# EAGLE board MecaArm_Final (EAGLE 9.7.0)
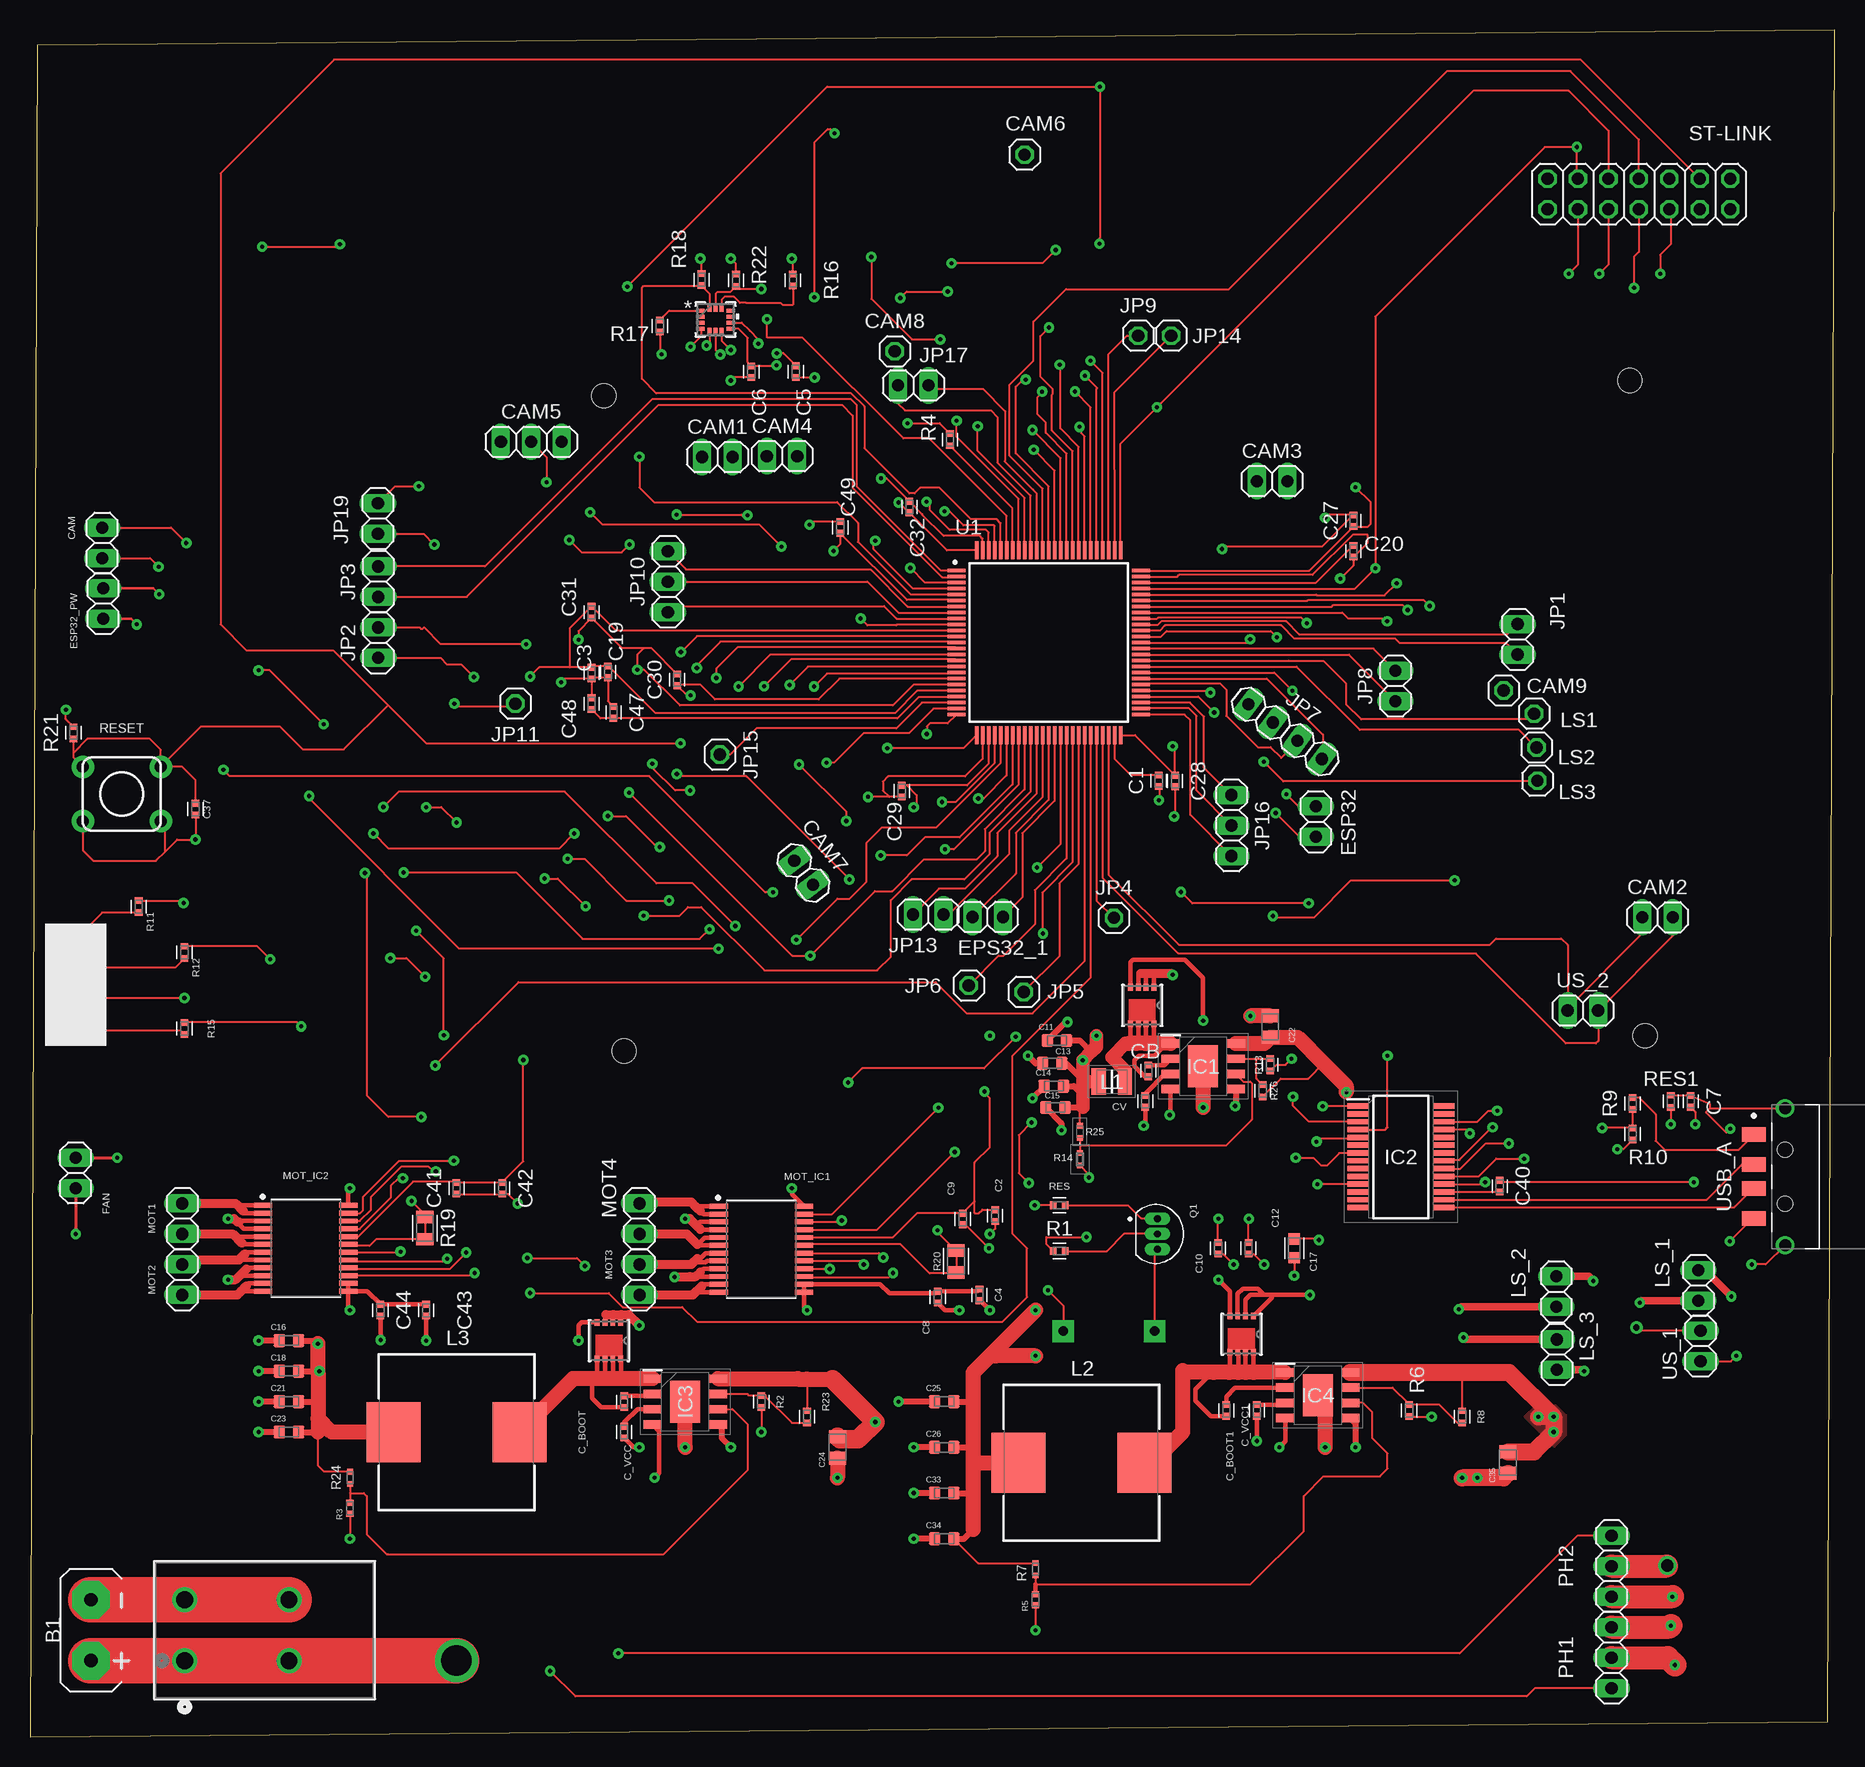
[diagram p2: board, top side]
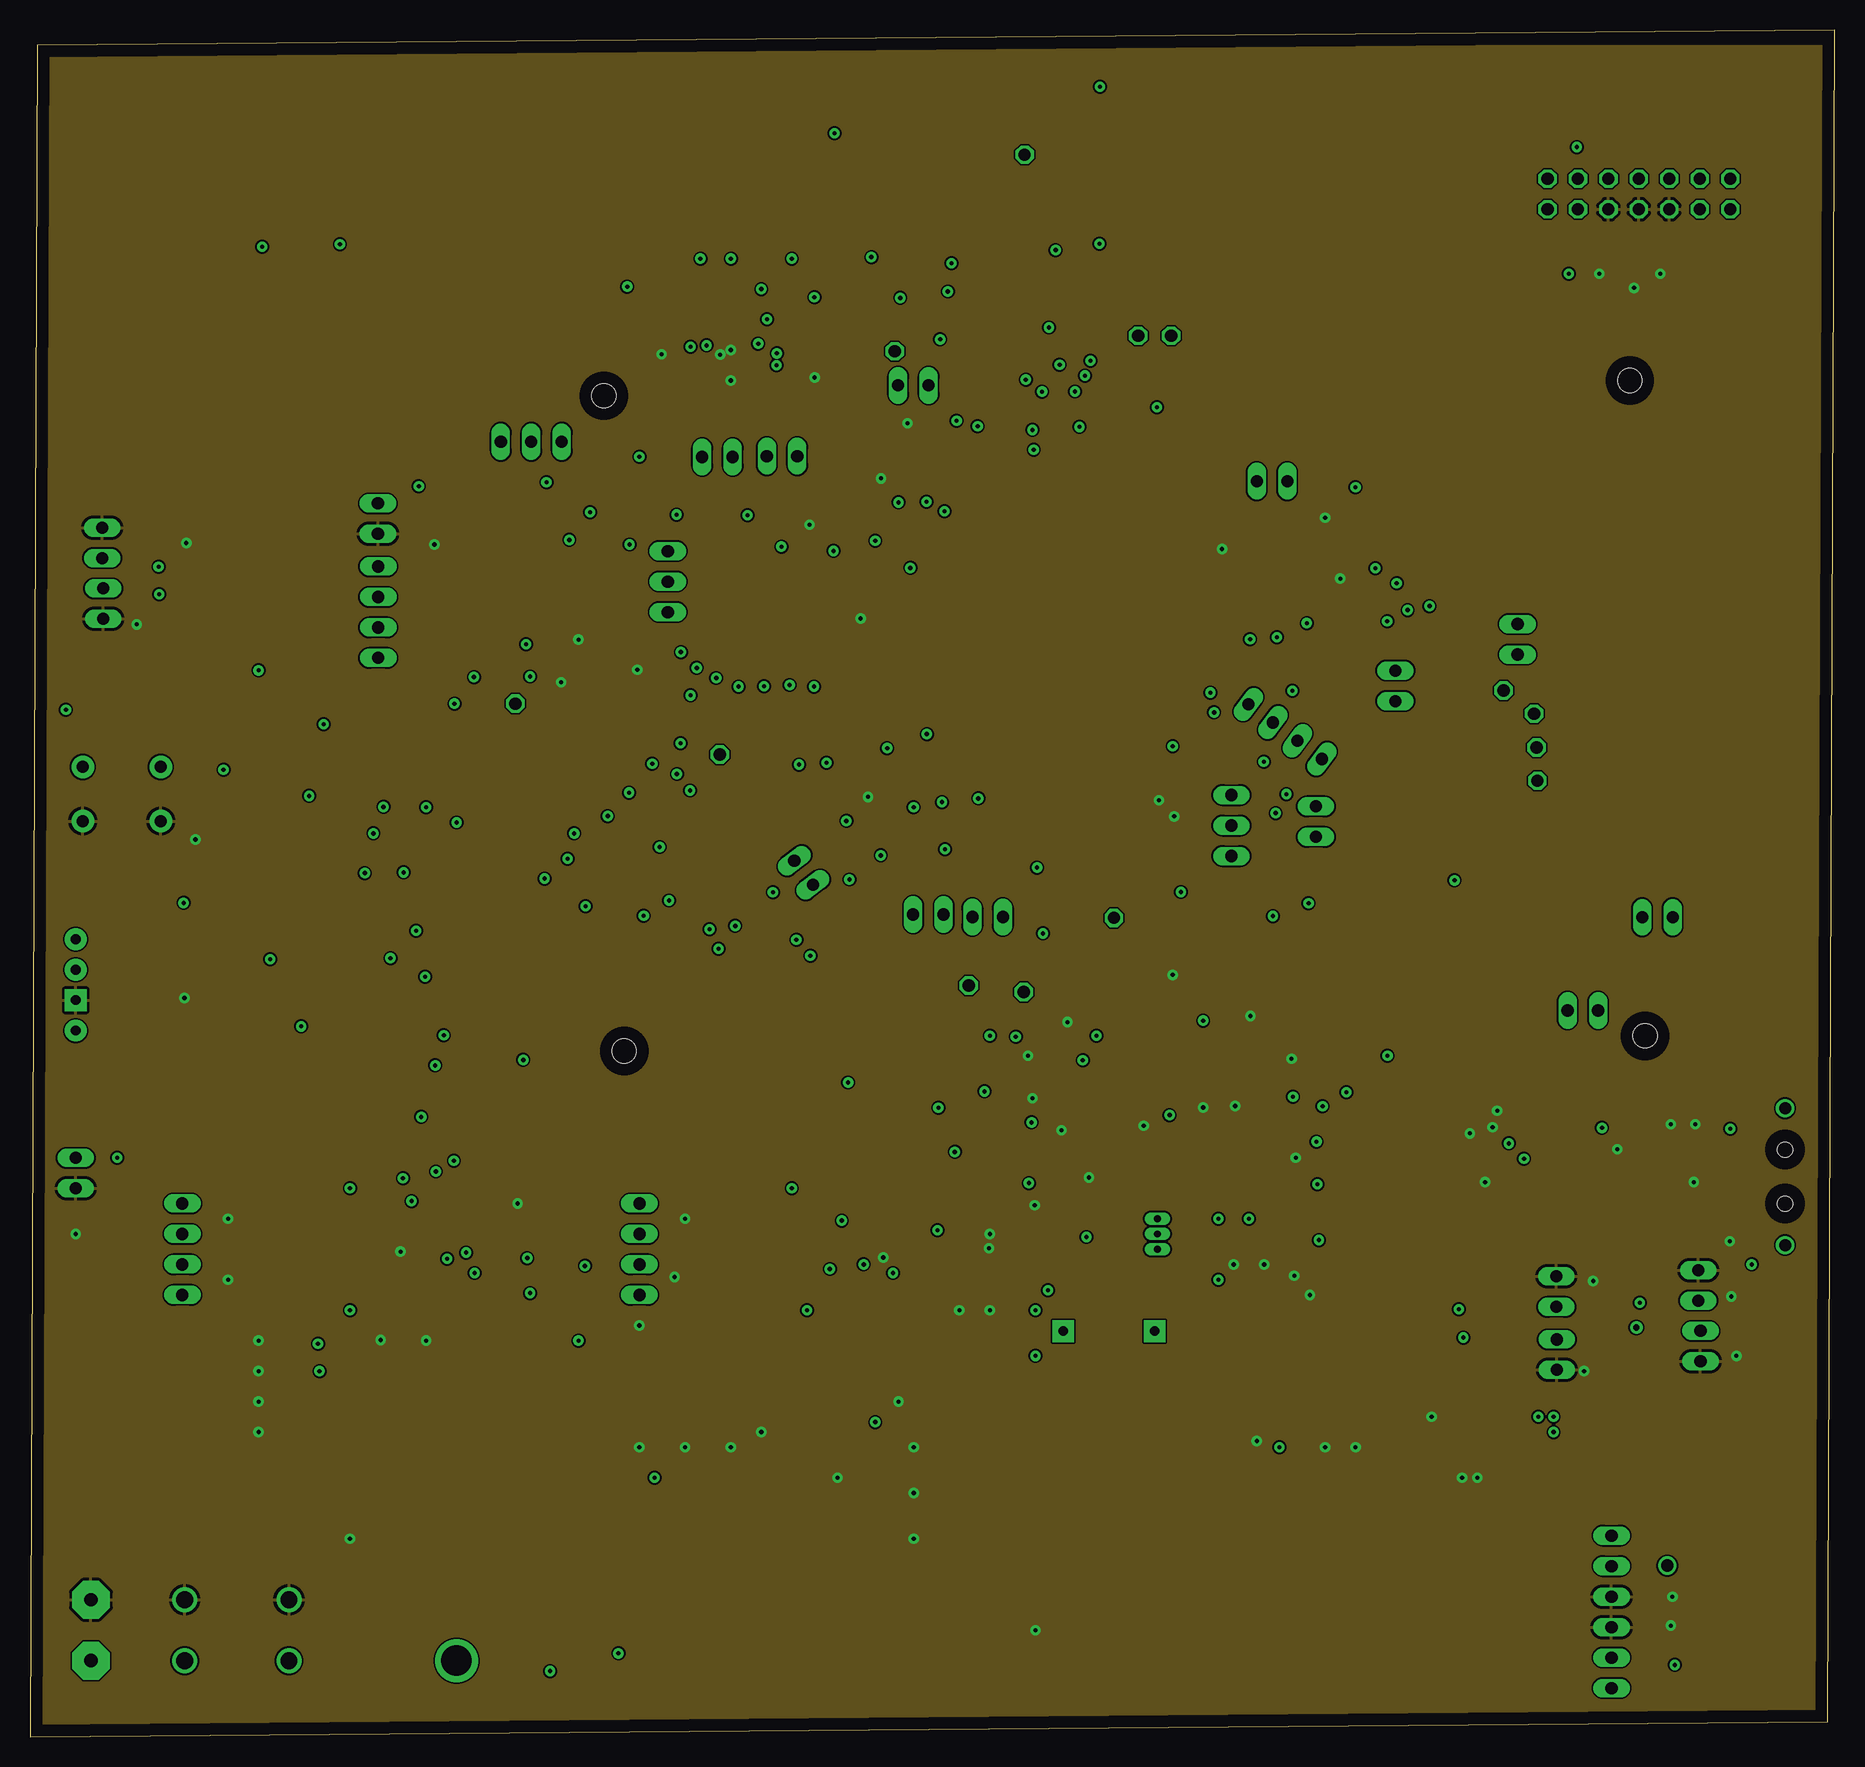
[diagram p3: board, inner layer Route2]
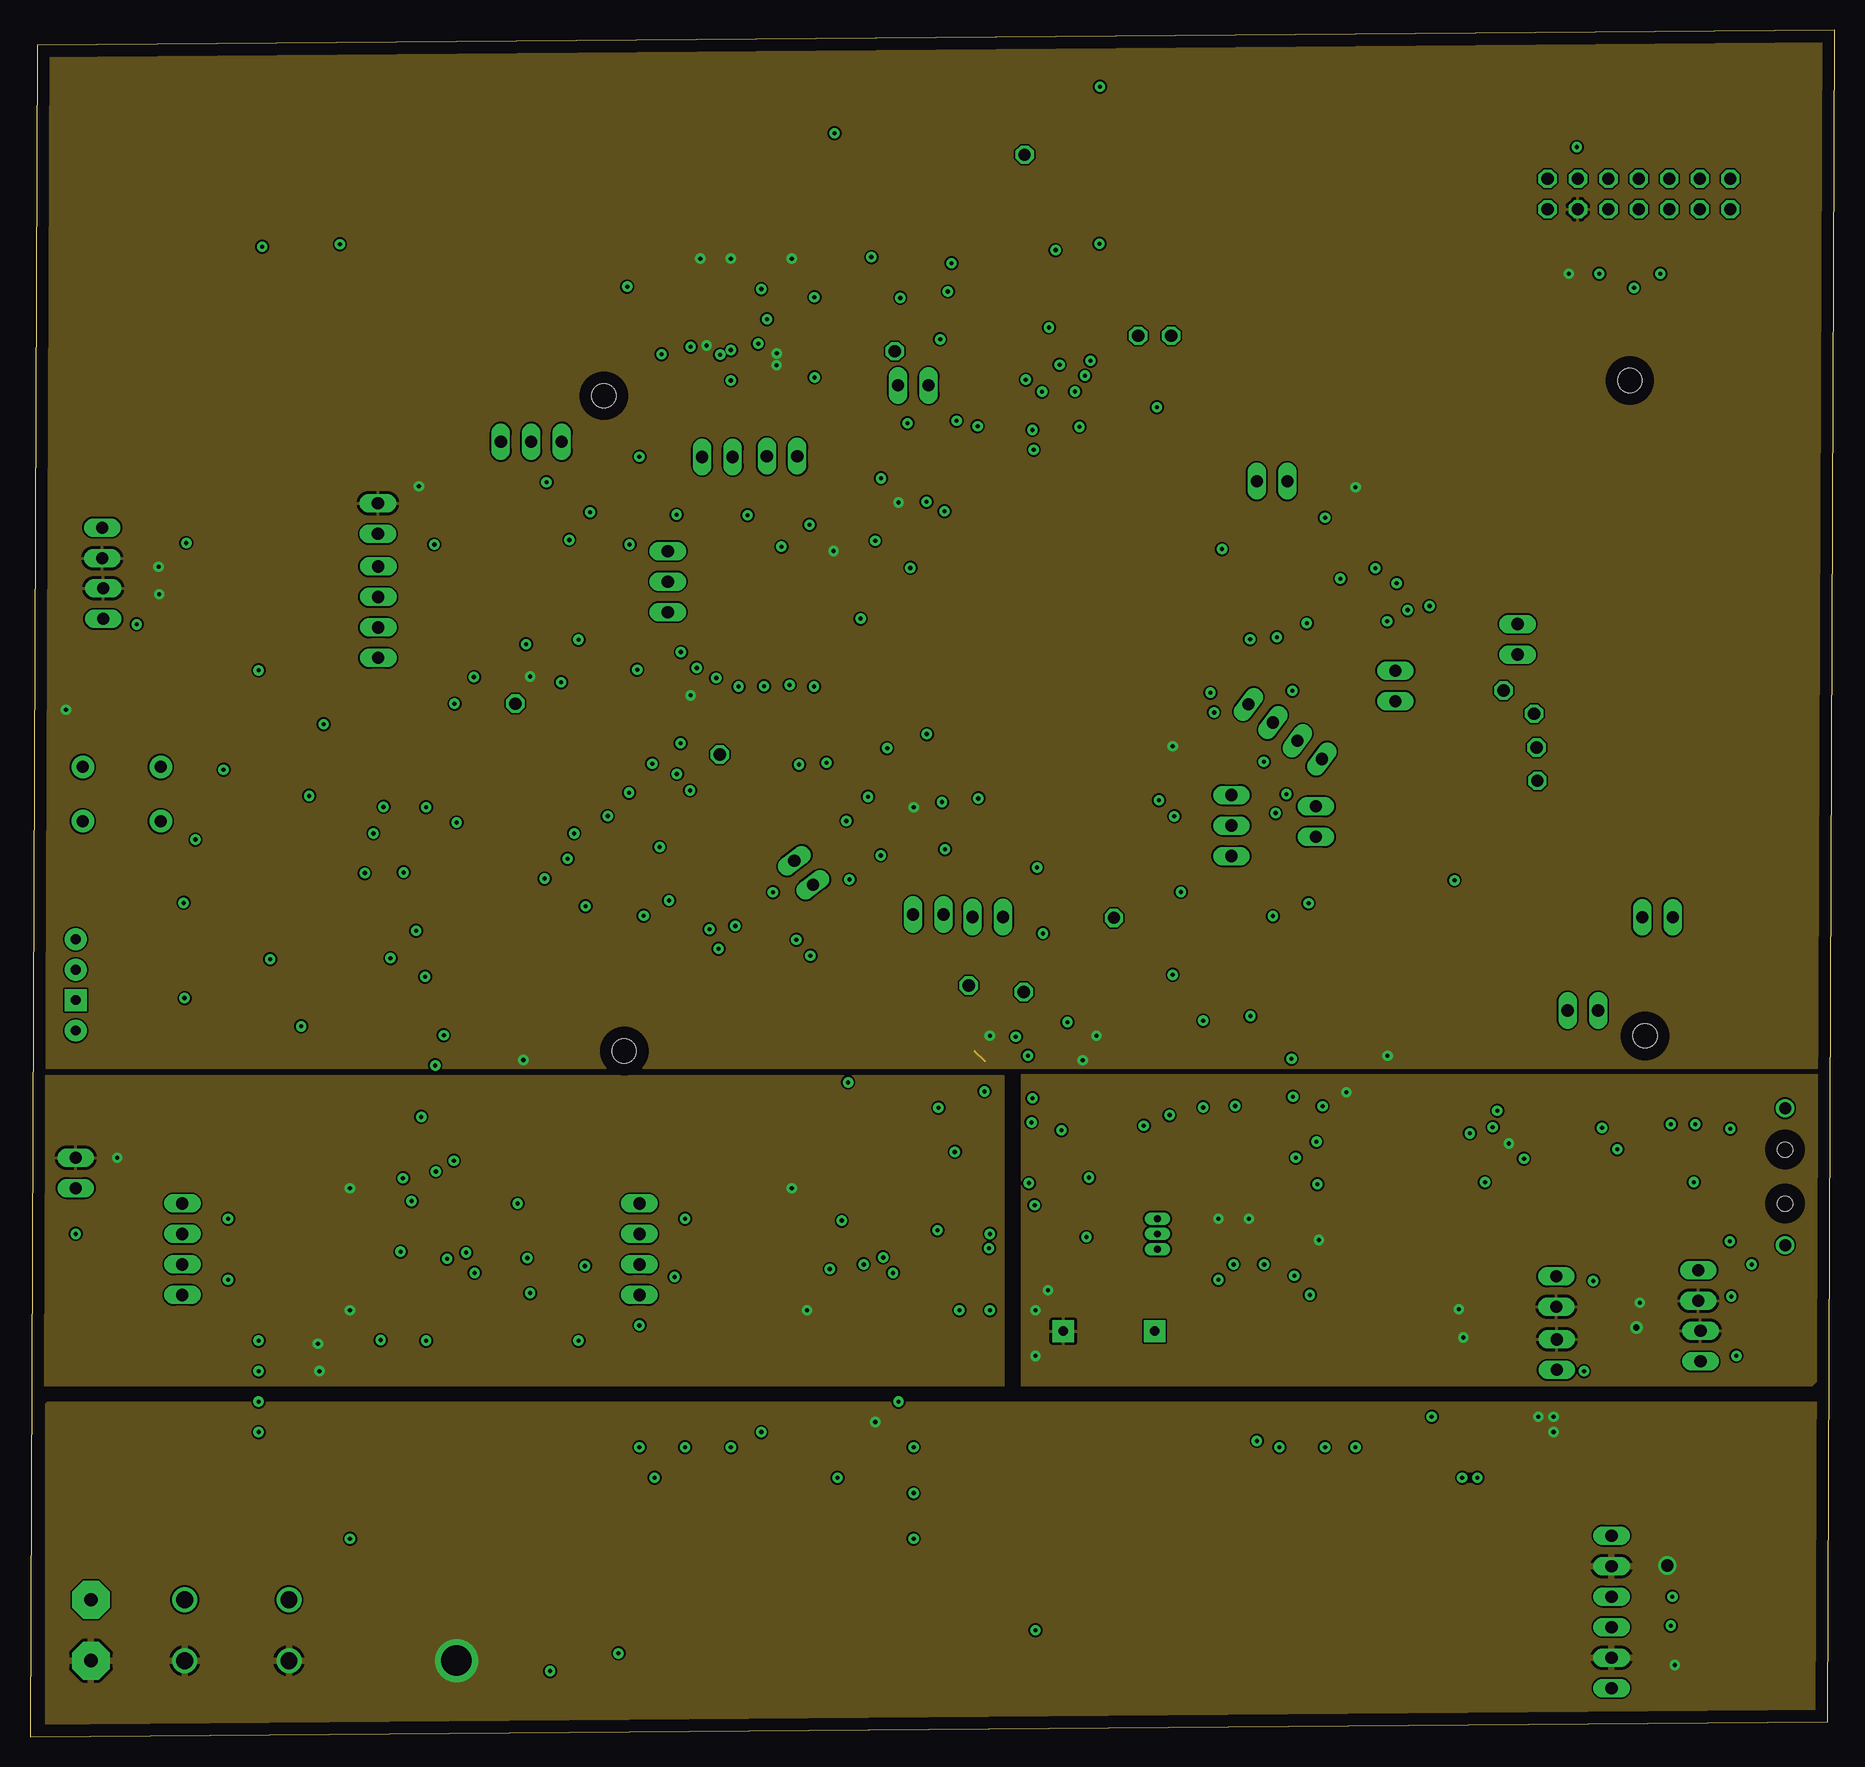
[diagram p4: board, inner layer Route15]
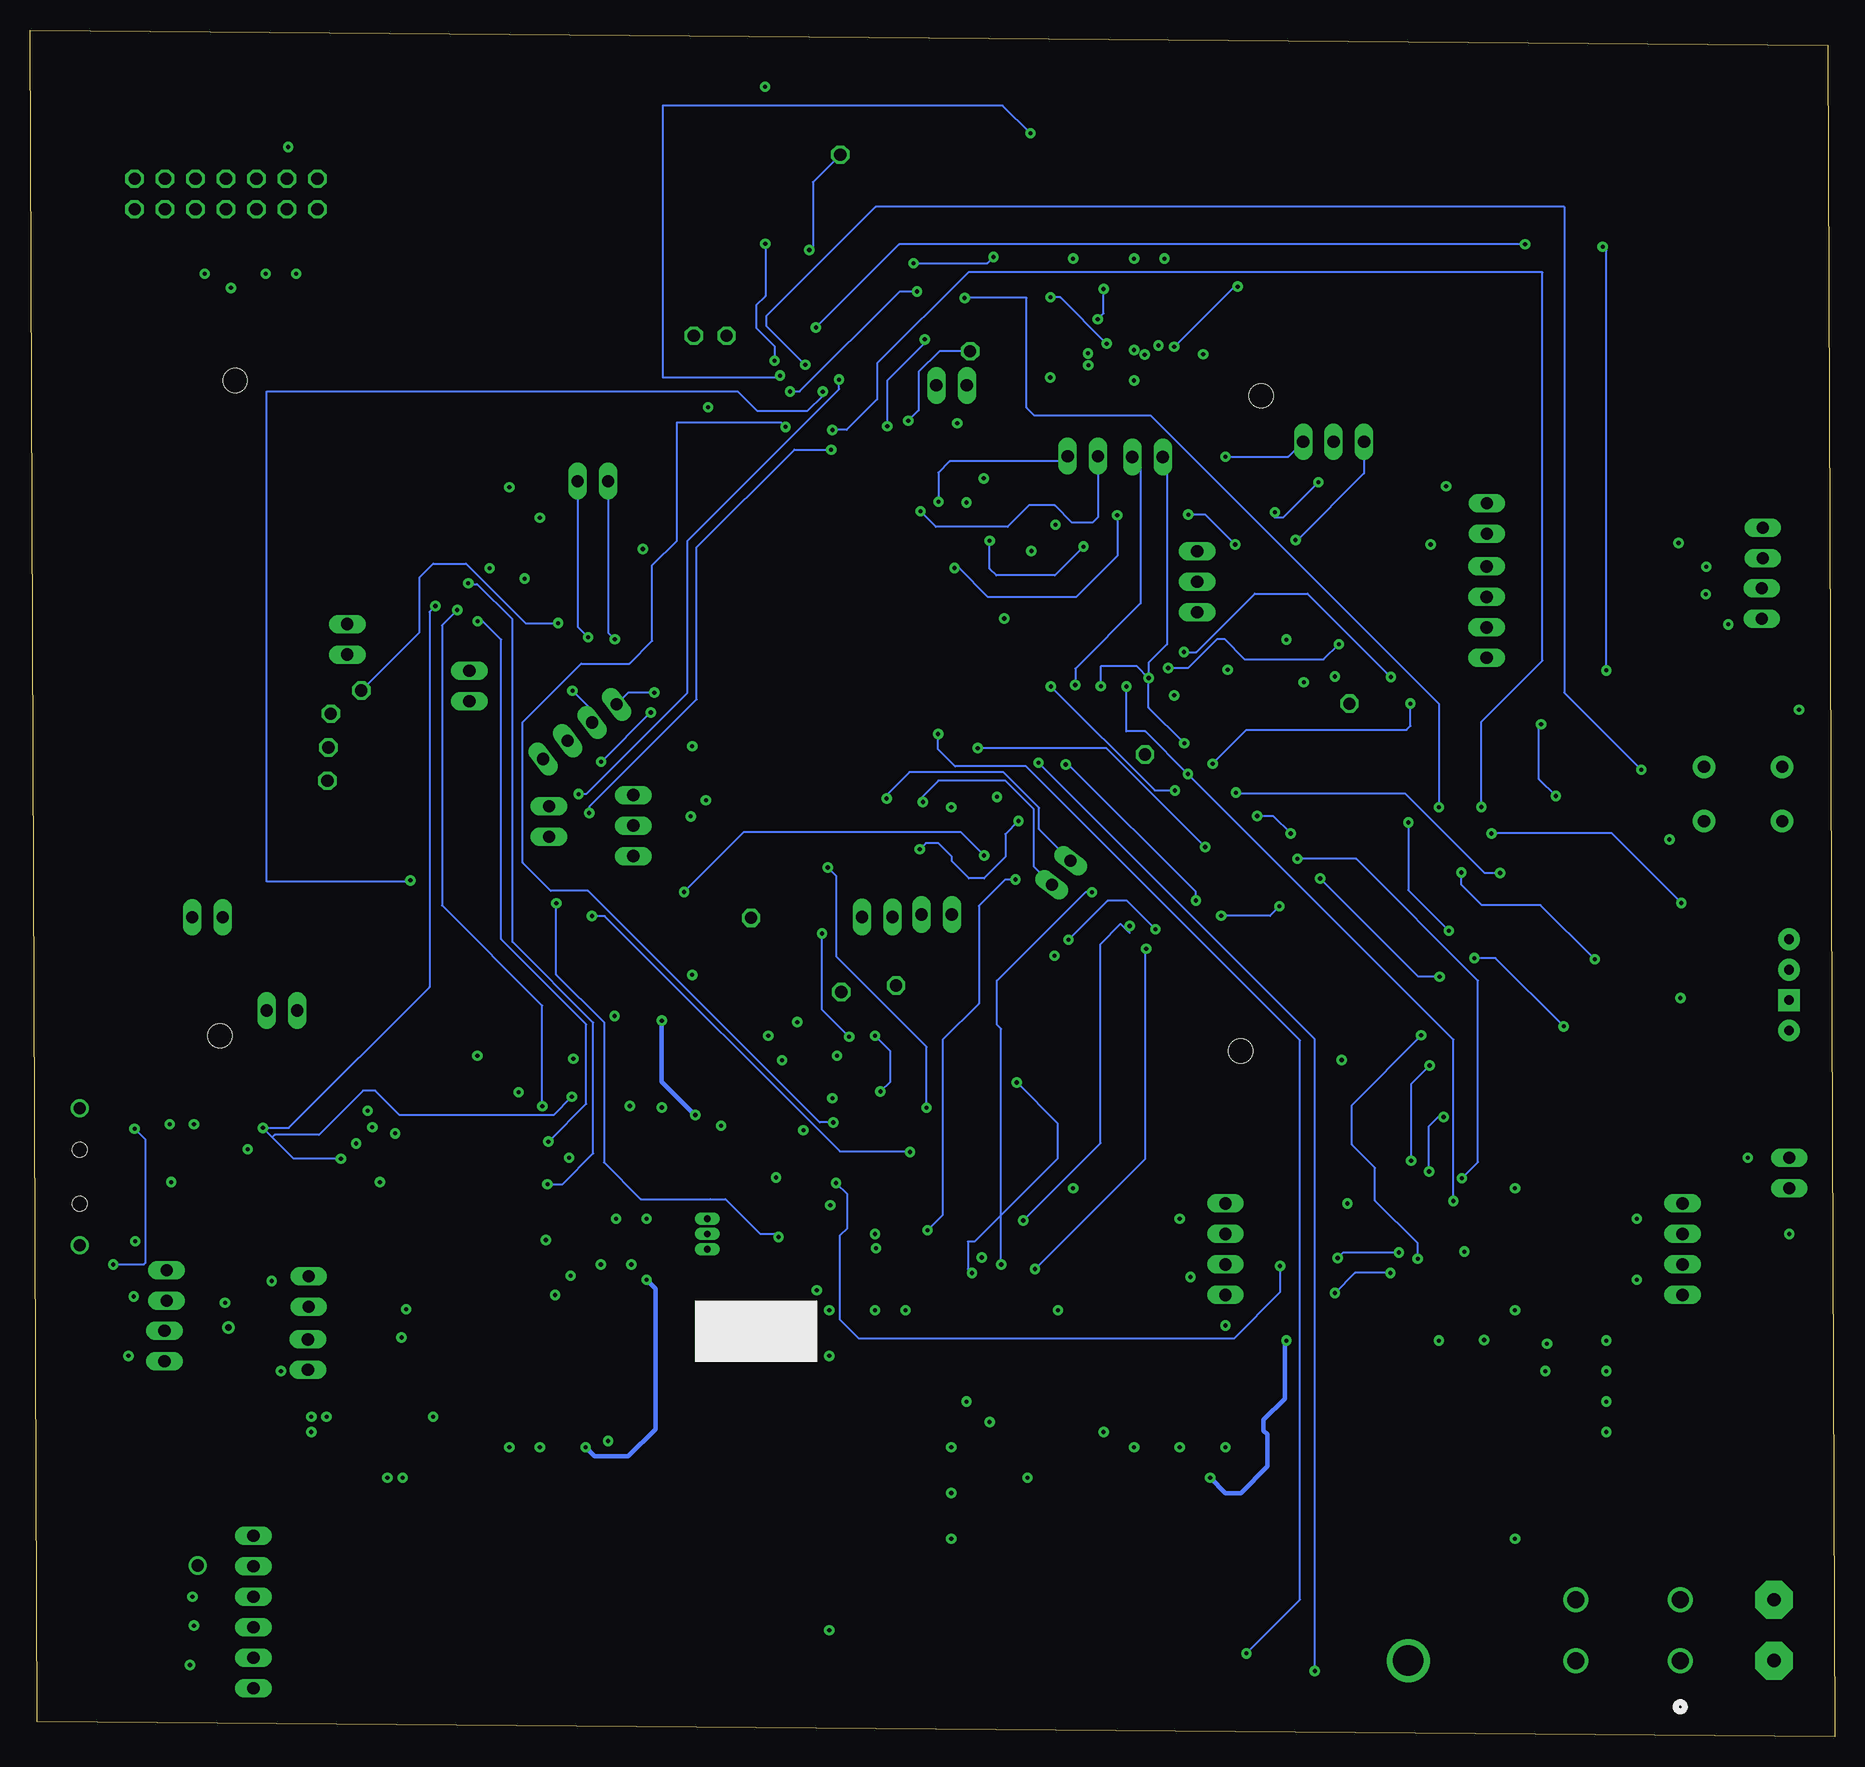
[diagram p5: board, bottom side, seen from below]

Size 150.45 x 142.24 mm. Coordinates in mm from the lower left corner, seen from the top.
Outline: 0,0 149.84,1.27 150.45,142.24 0.61,140.97 0,0
Copper layers (1*2*15*16): Top 0.035559375mm / dielectric 62mil / Route2 0.035559375mm / dielectric 62mil / Route15 0.035559375mm / dielectric 62mil / Bottom 0.035559375mm
Design rules "cmpe492-4Layer.edru": minimum track width 6mil, minimum drill 8mil, track to track 6mil, track to pad 6mil, pad to pad 6mil, via to via 6mil, smd to smd 6mil, copper to edge 40mil, drill to drill 20mil, minimum pad ring 10mil, minimum via ring 10mil, stop-mask expansion 4mil, vias tented up to drill 0mil, thermal gap 10mil
Holes 2 mm at 47.83,111.76 133.35,113.03 134.62,58.42 49.53,57.15

## Footprints (pad centres in the part's own frame; a part is rotated, then mirrored left to right if it is on the bottom)
BATTERY-GENERIC = drill 1.118 pad 3.15 octagon: + 2.54,0; - -2.54,0
BUZZER-FOOT = drill 0.8 pad 1.803 square: BUZ+ -3.81,0; BUZ- 3.81,0
CAPC1005X60 = smd 0.56 x 0.629: 1 -0.485,0; 2 0.485,0
CAPC1608X105N = smd 0.97 x 1.06: 1 -0.794,0; 2 0.794,0
CAPC1608X85 = smd 0.921 x 0.97: 1 -0.775,0; 2 0.775,0
CAPC2012X140N = smd 1.08 x 1.42: 1 -0.895,0; 2 0.895,0
1X02 = drill 1.016 long: 1 -1.27,0; 2 1.27,0
1X03 = drill 1.016 long: 1 -2.54,0; 2 0,0; 3 2.54,0
1X01 = drill 1.016 octagon: 1 0,0
SOIC127P600X175-9N = smd 1.522 x 0.7: 1 -2.714,1.905; 2 -2.714,0.635; 3 -2.714,-0.635; 4 -2.714,-1.905; 5 2.714,-1.905; 6 2.714,-0.635; 7 2.714,0.635; 8 2.714,1.905 | smd 2.5 x 3.5: 9 0,0
SOP65P780X200-28N = smd 1.8 x 0.45: 1 -3.55,4.225; 2 -3.55,3.575; 3 -3.55,2.925; 4 -3.55,2.275; 5 -3.55,1.625; 6 -3.55,0.975; 7 -3.55,0.325; 8 -3.55,-0.325; 9 -3.55,-0.975; 10 -3.55,-1.625; 11 -3.55,-2.275; 12 -3.55,-2.925; 13 -3.55,-3.575; 14 -3.55,-4.225; 15 3.55,-4.225; 16 3.55,-3.575; 17 3.55,-2.925; 18 3.55,-2.275; 19 3.55,-1.625; 20 3.55,-0.975; 21 3.55,-0.325; 22 3.55,0.325; 23 3.55,0.975; 24 3.55,1.625; 25 3.55,2.275; 26 3.55,2.925; 27 3.55,3.575; 28 3.55,4.225
CONN_1017491 = drill 1.397 pad 1.905: 1 -5.08,8.7; 2 -5.08,0; 3 0,8.7; 4 0,0
1X04 = drill 1.016 long: 1 -3.81,0; 2 -1.27,0; 3 1.27,0; 4 3.81,0
INDC2520X80N = smd 1.2 x 2.2: 1 -1.1,0; 2 1.1,0
WE-HCI_1365 = smd 4.5 x 5: 1 -5.25,0; 2 5.25,0
LED-FOOT = drill 0.8 pad 1.803: B 3.81,0; G 1.27,0; R -3.81,0 | drill 0.8 pad 1.803 square: COM -1.27,0
SOP65P760X160-24N = smd 1.515 x 0.409: 1 -3.548,3.575; 2 -3.548,2.925; 3 -3.548,2.275; 4 -3.548,1.625; 5 -3.548,0.975; 6 -3.548,0.325; 7 -3.548,-0.325; 8 -3.548,-0.975; 9 -3.548,-1.625; 10 -3.548,-2.275; 11 -3.548,-2.925; 12 -3.548,-3.575; 13 3.548,-3.575; 14 3.548,-2.925; 15 3.548,-2.275; 16 3.548,-1.625; 17 3.548,-0.975; 18 3.548,-0.325; 19 3.548,0.325; 20 3.548,0.975; 21 3.548,1.625; 22 3.548,2.275; 23 3.548,2.925; 24 3.548,3.575
TO92127P495H495-3 = drill 0.55 pad 0.508 long: 1 -1.27,0; 2 0,0; 3 1.27,0
RESC1005X40 = smd 0.535 x 0.644: 1 -0.507,0; 2 0.507,0
RESC1005X35N = smd 0.49 x 0.6: 1 -0.457,0; 2 0.457,0
RES_ERA2AEB9312X = smd 0.475 x 0.5: 1 -0.512,0; 2 0.512,0
ERA2AED122X = smd 0.475 x 0.5: 1 -0.512,0; 2 0.512,0
RESC2012X65 = smd 1.031 x 1.42: 1 -0.919,0; 2 0.919,0
ERJ2RKD1004X = smd 0.475 x 0.5: 1 -0.512,0; 2 0.512,0
SWITCH-MOMENTARY-PTH-6.5MM = drill 1.016 pad 1.88: 1 -3.251,2.261; 2 3.251,2.261; 3 -3.251,-2.261; 4 3.251,-2.261
2X07 = drill 1.016 octagon: 1 -7.62,-1.27; 2 -7.62,1.27; 3 -5.08,-1.27; 4 -5.08,1.27; 5 -2.54,-1.27; 6 -2.54,1.27; 7 0,-1.27; 8 0,1.27; 9 2.54,-1.27; 10 2.54,1.27; 11 5.08,-1.27; 12 5.08,1.27; 13 7.62,-1.27; 14 7.62,1.27
QFP50P1600X1600X160-100N = smd 1.5 x 0.3: 1 -7.7,6; 2 -7.7,5.5; 3 -7.7,5; 4 -7.7,4.5; 5 -7.7,4; 6 -7.7,3.5; 7 -7.7,3; 8 -7.7,2.5; 9 -7.7,2; 10 -7.7,1.5; 11 -7.7,1; 12 -7.7,0.5; 13 -7.7,0; 14 -7.7,-0.5; 15 -7.7,-1; 16 -7.7,-1.5; 17 -7.7,-2; 18 -7.7,-2.5; 19 -7.7,-3; 20 -7.7,-3.5; 21 -7.7,-4; 22 -7.7,-4.5; 23 -7.7,-5; 24 -7.7,-5.5; 25 -7.7,-6; 51 7.7,-6; 52 7.7,-5.5; 53 7.7,-5; 54 7.7,-4.5; 55 7.7,-4; 56 7.7,-3.5; 57 7.7,-3; 58 7.7,-2.5; 59 7.7,-2; 60 7.7,-1.5; 61 7.7,-1; 62 7.7,-0.5; 63 7.7,0; 64 7.7,0.5; 65 7.7,1; 66 7.7,1.5; 67 7.7,2; 68 7.7,2.5; 69 7.7,3; 70 7.7,3.5; 71 7.7,4; 72 7.7,4.5; 73 7.7,5; 74 7.7,5.5; 75 7.7,6 | smd 0.3 x 1.5: 26 -6,-7.7; 27 -5.5,-7.7; 28 -5,-7.7; 29 -4.5,-7.7; 30 -4,-7.7; 31 -3.5,-7.7; 32 -3,-7.7; 33 -2.5,-7.7; 34 -2,-7.7; 35 -1.5,-7.7; 36 -1,-7.7; 37 -0.5,-7.7; 38 0,-7.7; 39 0.5,-7.7; 40 1,-7.7; 41 1.5,-7.7; 42 2,-7.7; 43 2.5,-7.7; 44 3,-7.7; 45 3.5,-7.7; 46 4,-7.7; 47 4.5,-7.7; 48 5,-7.7; 49 5.5,-7.7; 50 6,-7.7; 76 6,7.7; 77 5.5,7.7; 78 5,7.7; 79 4.5,7.7; 80 4,7.7; 81 3.5,7.7; 82 3,7.7; 83 2.5,7.7; 84 2,7.7; 85 1.5,7.7; 86 1,7.7; 87 0.5,7.7; 88 0,7.7; 89 -0.5,7.7; 90 -1,7.7; 91 -1.5,7.7; 92 -2,7.7; 93 -2.5,7.7; 94 -3,7.7; 95 -3.5,7.7; 96 -4,7.7; 97 -4.5,7.7; 98 -5,7.7; 99 -5.5,7.7; 100 -6,7.7
LGA-14L_STM = smd 0.577 x 0.33: 1 -1.21,0.75; 2 -1.21,0.25; 3 -1.21,-0.25; 4 -1.21,-0.75; 8 1.21,-0.75; 9 1.21,-0.25; 10 1.21,0.25; 11 1.21,0.75 | smd 0.33 x 0.577: 5 -0.5,-0.956; 6 0,-0.956; 7 0.5,-0.956; 12 0.5,0.956; 13 0,0.956; 14 -0.5,0.956
MOSFET_4DN-T1-E3_VIS = smd 0.559 x 0.406: 1 -1.518,0.975; 2 -1.518,0.325; 3 -1.518,-0.325; 4 -1.518,-0.975 | smd 0.508 x 0.406: 5 1.518,-0.975; 6 1.518,-0.325; 7 1.518,0.325; 8 1.518,0.975
0480371000 = smd 1.2 x 2: 1 3.5,9.57; 2 1,9.57; 3 -1,9.57; 4 -3.5,9.57 | drill 1 slot 2.6 rotated 90: SH1 -5.7,6.97; SH2 5.7,6.97 | hole 1.25: -2.25,6.97; 2.25,6.97

## Placement (x,y rotation side)
B1  BATTERY-7.4V  [BATTERY-GENERIC]  5.08,8.89 270 top
BUZZER  BUZZER_ACTIVE_12X9P5  [BUZZER-FOOT]  89.94,33.81 180 bottom
C1  2.2 µF  [CAPC1005X60]  94.08,79.68 270 top
C2  0.1 µF  [CAPC1005X60]  80.44,43.43 90 top
C3  1 µF  [CAPC1005X60]  46.81,88.65 90 top
C4  0.1 µF  [CAPC1005X60]  79.15,36.83 90 top
C5  4.7µF  [CAPC1005X60]  63.83,113.77 90 top
C6  0.1 µF  [CAPC1005X60]  60.12,113.77 90 top
C7  100nF  [CAPC1005X60]  138.43,52.96 270 top
C8  10 µF  [CAPC1005X60]  75.67,36.65 90 top
C9  10 µF  [CAPC1005X60]  77.75,43.15 90 top
C10  100nF  [CAPC1005X60]  99.03,40.72 270 top
C11  CL10A226MP8NUNE  [CAPC1608X105N]  85.6,58.04 0 top
C12  100nF  [CAPC1005X60]  101.57,40.72 270 top
C13  CL10A226MP8NUNE  [CAPC1608X105N]  85.22,56.13 0 top
C14  CL10A226MP8NUNE  [CAPC1608X105N]  85.34,54.23 0 top
C15  CL10A226MP8NUNE  [CAPC1608X105N]  85.47,52.45 0 top
C16  CL10A226MP8NUNE  [CAPC1608X105N]  21.59,33.02 0 top
C17  4.7 μF  [CAPC1608X85]  105.38,40.72 90 top
C18  CL10A226MP8NUNE  [CAPC1608X105N]  21.59,30.48 0 top
C19  100nF  [CAPC1005X60]  48.18,88.75 90 top
C20  2.2 µF  [CAPC1005X60]  110.31,98.81 270 top
C21  CL10A226MP8NUNE  [CAPC1608X105N]  21.59,27.94 0 top
C22  GRM21BR61A226ME51L  [CAPC2012X140N]  103.38,59.18 270 top
C23  CL10A226MP8NUNE  [CAPC1608X105N]  21.59,25.4 0 top
C24  GRM21BR61A226ME51L  [CAPC2012X140N]  67.31,24.13 90 top
C25  CL10A226MP8NUNE  [CAPC1608X105N]  76.2,27.94 0 top
C26  CL10A226MP8NUNE  [CAPC1608X105N]  76.2,24.13 0 top
C27  100nF  [CAPC1005X60]  110.31,101.35 90 top
C28  100nF  [CAPC1005X60]  95.45,79.65 270 top
C29  100nF  [CAPC1005X60]  72.67,78.82 270 top
C30  100nF  [CAPC1005X60]  53.95,88.09 90 top
C31  100nF  [CAPC1005X60]  46.81,93.73 270 top
C32  100nF  [CAPC1005X60]  73.3,102.49 90 top
C33  CL10A226MP8NUNE  [CAPC1608X105N]  76.2,20.32 0 top
C34  CL10A226MP8NUNE  [CAPC1608X105N]  76.2,16.51 0 top
C35  GRM21BR61A226ME51L  [CAPC2012X140N]  123.19,22.86 90 top
C37  100nF  [CAPC1005X60]  13.79,77.32 270 top
C40  100nF  [CAPC1005X60]  122.5,45.9 90 top
C41  10 µF  [CAPC1005X60]  35.56,45.72 90 top
C42  0.1 µF  [CAPC1005X60]  39.37,45.72 90 top
C43  10 µF  [CAPC1005X60]  33.02,35.56 90 top
C44  0.1 µF  [CAPC1005X60]  29.21,35.56 90 top
C47  1 µF  [CAPC1005X60]  48.64,85.37 90 top
C48  100nF  [CAPC1005X60]  46.81,86.11 90 top
C49  100nF  [CAPC1005X60]  67.54,100.79 90 top
C_BOOT  1 µF  [CAPC1005X60]  49.53,27.94 90 top
C_BOOT1  1µF  [CAPC1005X60]  99.72,27.2 90 top
C_VCC  1 µF  [CAPC1005X60]  49.53,25.4 90 top
C_VCC1  1 µF  [CAPC1005X60]  102.26,27.2 90 top
CAM  PINHD-1X2  [1X02]  6.02,99.49 90 top
CAM1  PINHD-1X2  [1X02]  57.3,106.65 0 top
CAM2  PINHD-1X2  [1X02]  135.66,68.3 0 top
CAM3  PINHD-1X2  [1X02]  103.53,104.65 0 top
CAM4  PINHD-1X2  [1X02]  62.69,106.73 0 top
CAM5  PINHD-1X3  [1X03]  41.78,107.92 0 top
CAM6  PINHD-1X1  [1X01]  82.91,131.85 0 top
CAM7  PINHD-1X2  [1X02]  64.49,72.01 127.6 top
CAM8  PINHD-1X1  [1X01]  72.09,115.47 0 top
CAM9  PINHD-1X1  [1X01]  122.83,87.2 0 top
CB  1µF  [CAPC1005X60]  93.22,55.5 90 top
CV  1 µF  [CAPC1005X60]  92.96,52.96 90 top
EPS32_1  PINHD-1X2  [1X02]  79.83,68.33 180 top
ESP32  PINHD-1X2  [1X02]  107.19,76.28 90 top
ESP32_PW  PINHD-1X2  [1X02]  6.1,94.44 270 top
FAN  PINHD-1X2  [1X02]  3.81,46.99 270 top
IC1  RT7258GSP  [SOIC127P600X175-9N]  97.79,55.88 0 top
IC2  FT232RL-REEL  [SOP65P780X200-28N]  114.27,48.34 0 top
IC3  RT7258GSP  [SOIC127P600X175-9N]  54.61,27.94 0 top
IC4  RT7258GSP  [SOIC127P600X175-9N]  107.34,28.47 0 top
J1  1017503CONN_1017491  [CONN_1017491]  21.59,11.43 90 top
JP1  PINHD-1X2  [1X02]  124,91.47 90 top
JP2  PINHD-1X2  [1X02]  29.03,91.19 90 top
JP3  PINHD-1X2  [1X02]  29.03,96.27 270 top
JP4  PINHD-1X1  [1X01]  90.35,68.25 0 top
JP5  PINHD-1X1  [1X01]  82.83,62.08 0 top
JP6  PINHD-1X1  [1X01]  78.26,62.61 0 top
JP7  PINHD-1X4  [1X04]  104.62,83.77 323.4 top
JP8  PINHD-1X2  [1X02]  113.82,87.58 90 top
JP9  PINHD-1X1  [1X01]  92.38,116.76 0 top
JP10  PINHD-1X3  [1X03]  53.16,96.27 90 top
JP11  PINHD-1X1  [1X01]  40.46,86.11 0 top
JP13  PINHD-1X2  [1X02]  74.88,68.53 180 top
JP14  PINHD-1X1  [1X01]  95.12,116.76 0 top
JP15  PINHD-1X1  [1X01]  57.51,81.86 0 top
JP16  PINHD-1X3  [1X03]  100.15,75.95 270 top
JP17  PINHD-1X2  [1X02]  73.63,112.62 0 top
JP19  PINHD-1X2  [1X02]  29.01,101.52 270 top
L1  CIGT252008LM2R2MNE  [INDC2520X80N]  90.17,54.61 0 top
L2  WE-HCI_1365  [WE-HCI_1365]  87.63,22.86 0 top
L3  WE-HCI_1365  [WE-HCI_1365]  35.56,25.4 0 top
LED  LED  [LED-FOOT]  3.81,62.66 90 top
LS1  PINHD-1X1  [1X01]  125.37,85.27 0 top
LS2  PINHD-1X1  [1X01]  125.58,82.45 0 top
LS3  PINHD-1X1  [1X01]  125.65,79.68 0 top
LS_1  PINHD-1X2  [1X02]  139.06,37.62 90 top
LS_2  PINHD-1X2  [1X02]  127.23,37.11 90 top
LS_3  PINHD-1X2  [1X02]  127.28,31.85 270 top
MOT1  PINHD-1X2  [1X02]  12.7,43.18 270 top
MOT2  PINHD-1X2  [1X02]  12.7,38.1 90 top
MOT3  PINHD-1X2  [1X02]  50.8,38.1 90 top
MOT4  PINHD-1X2  [1X02]  50.8,43.18 270 top
MOT_IC1  TB6612FNGSSOP24  [SOP65P760X160-24N]  60.96,40.64 0 top
MOT_IC2  TB6612FNGSSOP24  [SOP65P760X160-24N]  22.99,40.72 0 top
PH1  PINHD-1X3  [1X03]  131.83,6.6 90 top
PH2  PINHD-1X3  [1X03]  131.83,14.22 270 top
Q1  2N3904  [TO92127P495H495-3]  93.98,41.91 270 top
R1  10kΩ  [RESC1005X40]  85.8,40.49 0 top
R2  100 kΩ  [RESC1005X40]  60.96,27.94 90 top
R3  CPF0402B18KE1  [RESC1005X35N]  26.67,19.05 90 top
R4  100 kΩ  [RESC1005X40]  76.68,108.1 90 top
R5  CPF0402B18KE1  [RESC1005X35N]  83.82,11.43 90 top
R6  100 kΩ  [RESC1005X40]  114.96,27.2 90 top
R7  ERA2AEB9312X  [RES_ERA2AEB9312X]  83.82,13.97 90 top
R8  100 kΩ  [RESC1005X40]  119.38,26.67 90 top
R9  4700 Ω  [RESC1005X40]  133.58,52.78 90 top
R10  10000 Ω  [RESC1005X40]  133.58,50.24 90 top
R11  240 Ω  [RESC1005X40]  9.07,69.19 90 top
R12  39 Ω  [RESC1005X40]  12.88,65.38 90 top
R13  100 kΩ  [RESC1005X40]  103.38,56.01 90 top
R14  ERA-2AEB203X  [ERA2AED122X]  87.5,48.13 90 top
R15  39 Ω  [RESC1005X40]  12.88,59.03 90 top
R16  4.7kΩ  [RESC1005X40]  63.59,121.4 90 top
R17  4.7kΩ  [RESC1005X40]  52.5,117.58 90 top
R18  4.7kΩ  [RESC1005X40]  55.98,121.44 90 top
R19  10kΩ  [RESC2012X65]  32.92,42.39 270 top
R20  10kΩ  [RESC2012X65]  77.19,39.62 270 top
R21  10 kΩ  [RESC1005X40]  3.63,83.67 270 top
R22  4.7kΩ  [RESC1005X40]  58.85,121.39 90 top
R23  100 kΩ  [RESC1005X40]  64.77,26.67 90 top
R24  ERA2AEB9312X  [RES_ERA2AEB9312X]  26.67,21.59 90 top
R25  ERJ-2RKF6202X  [ERJ2RKD1004X]  87.5,50.42 90 top
R26  100 kΩ  [RESC1005X40]  102.74,53.85 270 top
RES  100kΩ  [RESC1005X40]  85.8,44.3 0 top
RES1  1 MΩ  [RESC1005X40]  136.78,52.96 90 top
RESET  SWITCH_MOMENTARY  [SWITCH-MOMENTARY-PTH-6.5MM]  7.65,78.57 0 top
ST-LINK  PINHD-2X7  [2X07]  134.11,128.57 0 top
U1  STM32F429VIT6  [QFP50P1600X1600X160-100N]  84.91,91.19 0 top
U2  LSM6DSRXTR_ALGA-14L_STM  [LGA-14L_STM]  57.15,118.11 0 top
U3  SI7114DN-T1-E3MOSFET_4DN-T1-E3_VIS  [MOSFET_4DN-T1-E3_VIS]  48.26,33.02 270 top
U4  SI7114DN-T1-E3MOSFET_4DN-T1-E3_VIS  [MOSFET_4DN-T1-E3_VIS]  92.71,60.96 270 top
U5  SI7114DN-T1-E3MOSFET_4DN-T1-E3_VIS  [MOSFET_4DN-T1-E3_VIS]  100.99,33.55 270 top
US_1  PINHD-1X2  [1X02]  139.24,32.56 270 top
US_2  PINHD-1X2  [1X02]  129.44,60.53 0 top
USB_A  0480371000  [0480371000]  153.26,46.69 90 top

## Tracks (layer width: path | path; a pad name or v marks a point on that pad's centre or on a via)
3V3OUT
  Top 0.152: IC2.17 C40.1
AIN1  (via drill 0.35)
  Top 0.152: U1.33 82.41,79.36 77.01,73.97 v76.28,73.97 | MOT_IC2.21 27.48,42.34 30.1,44.96 30.1,45.95 30.71,46.56 v31.09,46.56 | v44.81,73.18 46.23,73.18 49.71,69.7 v53.26,69.7 | v68.05,76.33 68.05,77.09 v64.11,81.03
  Bottom 0.152: v31.09,46.56 29.74,47.9 29.74,63.02 39.9,73.18 v44.81,73.18 | v53.26,69.7 53.26,70.41 63.88,81.03 v64.11,81.03 | v68.05,76.33 69.14,75.23 69.14,73.33 70.92,71.55 72.19,71.55 73.61,72.97 73.61,73.36 74.73,74.47 75.77,74.47 v76.28,73.97
AIN1_1  (via drill 0.35)
  Top 0.152: U1.85 86.41,106.93 84.68,108.66 84.68,109.53 84,110.21 84,111.65 84.37,112.01 v84.37,112.1 | MOT_IC1.21 70.61,42.26 v77.09,48.74 | v118.75,71.37 110.11,71.37 107.01,68.28 103.73,68.28 v103.61,68.4
  Bottom 0.152: v77.09,48.74 77.14,48.79 82.93,48.79 102.54,68.4 v103.61,68.4 | v118.75,71.37 118.85,71.27 130.71,71.27 130.71,112.12 91.47,112.12 89.87,110.52 85.62,110.52 84.37,111.77 v84.37,112.1
AIN2  (via drill 0.35)
  Top 0.152: U1.34 82.91,78.95 79.6,75.64 79.6,73.81 78.89,73.1 74.5,73.1 71.88,70.48 70.43,70.48 v65.05,65.1 63.53,65.1 v49.94,78.69 | MOT_IC2.22 27.5,42.99 28.42,43.92 28.42,45.01 30.96,47.55 33.2,47.55 33.63,47.12 v33.83,47.12 | v32.61,51.66 29.87,51.66 28.09,53.44 28.09,71.81 v27.91,71.98
  Bottom 0.152: v33.83,47.12 33.83,50.9 33.07,51.66 v32.61,51.66 | v27.91,71.98 29.18,71.98 35.79,78.59 49.86,78.59 49.94,78.66 v49.94,78.69
AIN2_1  (via drill 0.35)
  Top 0.152: U1.86 85.91,106.57 v83.57,108.92 | MOT_IC1.22 67.55,42.91 v67.67,43.03 | v58.79,67.58 55.25,71.12 52.22,71.12 44.58,78.77 30.73,78.77 v29.46,77.5
  Bottom 0.152: v67.67,43.03 61.21,49.48 61.21,66.06 59.54,67.74 58.79,66.99 v58.79,67.58 | v29.46,77.5 29.46,84.61 24.38,89.69 24.38,122.05 72.24,122.05 79.83,114.45 79.83,111.45 82.37,108.92 v83.57,108.92
AO
  Top 0.381: MOT_IC2.1 17.3,44.29 17.14,44.45 | MOT_IC2.2 17.95,43.64 17.78,43.81
  Top 0.762: MOT1.1 17.14,44.45 17.78,43.81
AO1
  Top 0.381: MOT_IC1.1 55.52,44.21 55.5,44.2 | MOT_IC1.2 56.13,43.56 55.88,43.81
  Top 0.762: MOT4.1 50.93,44.58 55.12,44.58 55.5,44.2 55.88,43.81
AO2
  Top 0.381: MOT_IC2.5 17.11,41.69 16.89,41.91 | MOT_IC2.6 17.76,41.04 17.65,41.15
  Top 0.762: MOT1.2 16.89,41.91 17.65,41.15
AO3
  Top 0.381: MOT_IC1.5 56.22,41.61 55.63,41.02 55.68,40.96 MOT_IC1.6
  Top 0.762: MOT4.2 54.74,41.91 55.63,41.02
BASE
  Top 0.152: U1.59 105.58,89.19 110.85,83.92 124.1,83.92 LS2.1
BASE_1  (via drill 0.35)
  Top 0.152: U1.54 97.39,86.69 v98.7,85.37 | LS3.1 125.6,79.63 104.47,79.63 v102.84,81.26
  Bottom 0.152: v102.84,81.26 102.82,81.26 v98.7,85.37
BASE_2
  Top 0.152: R1.2 89.76,40.49 91.19,41.91 Q1.2
BAT_7.4V  (via drill 0.35, 1.02, 2.54)
  Top 0.152: 64.03,29.82 64.01,29.84 | 64.77,29.82 R23.2 | R8.2 119.38,30.38
  Top 0.381: 136.42,14.22 v136.47,14.28
  Top 1.27: IC3.8 64.01,29.84 | 64.03,29.82 64.77,29.82 66.88,29.82
  Top 1.422: IC4.8 119.38,30.38 123.29,30.38 v127,26.67 | C35.2 125.36,23.75 v127,25.4 v127,26.67 | v127,26.67 v125.73,26.67
  Top 1.524: 66.88,29.82 v70.46,26.24 69.04,24.82 67.52,24.82 C24.2
  Top 1.905: PH1.2 136.5,6.6 v137.11,5.99 | PH2.2 136.42,14.22
  Top 3.81: B1.+ J1.1 J1.2 v35.56,6.35
  pour Route15: 1.54,0.27 149.59,0.27 149.59,27.67 1.54,27.67
  pour Top: 124.57,26.67 127.06,24.17 128.07,25.18 128.07,26.77 127.22,27.61 125.51,27.61
BG  (via drill 0.35)
  Top 0.381: IC3.4 52.45,25.48 52.45,21.97 v52.07,21.59 | v45.72,33.02 45.72,34.29 45.97,34.54 U3.4
  Bottom 0.152: 45.85,32.89 v45.72,33.02
  Bottom 0.381: 45.85,32.89 45.85,28.19 47.62,26.42 47.62,25.53 47.31,25.21 47.31,22.54 49.53,20.32 50.8,20.32 v52.07,21.59
BG_1  (via drill 0.35)
  Top 0.381: IC4.4 104.63,24.62 v104.14,24.13 | v99.06,38.1 100.02,37.14 U5.4
  Bottom 0.381: v104.14,24.13 103.38,23.37 100.58,23.37 98.3,25.65 98.3,37.34 v99.06,38.1
BG_2  (via drill 0.35)
  Top 0.381: U4.4 91.73,64.56 91.95,64.77 96.27,64.77 97.79,63.25 v97.79,59.69 | IC1.4 95.08,51.9 v95,51.82
  Bottom 0.381: v97.79,59.69 97.79,54.61 v95,51.82
BIN1  (via drill 0.35)
  Top 0.152: U1.81 88.41,110.8 v87.1,112.12 | MOT_IC2.17 26.68,39.6 34.52,39.6 v34.77,39.85 | v34.49,58.47 34.49,64.87 v32.18,67.18 | v72.54,119.91 73.08,120.45 v76.5,120.45 | v35.56,76.2 34.29,77.47 v33.02,77.47
  Bottom 0.152: v34.77,39.85 34.77,41.12 38.33,44.68 38.33,47.42 40.26,49.35 40.26,52.65 34.49,58.42 v34.49,58.47 | v72.54,119.91 67.39,119.91 67.39,110.77 66.73,110.11 57.02,110.11 33.02,86.11 v33.02,77.47 | v76.5,120.45 77.95,120.45 86.28,112.12 v87.1,112.12 | v35.56,76.2 35.56,70.56 v32.18,67.18
BIN1_1  (via drill 0.35)
  Top 0.152: U1.83 87.41,107.51 85.88,109.04 85.88,114.35 v85.83,114.35 | MOT_IC1.17 69.2,39.66 v69.49,39.37 | v61.92,70.38 61.29,70.38 51.61,80.06 16.66,80.06 v16.13,80.59
  Bottom 0.152: v69.49,39.37 69.49,59 69.85,59.36 69.85,63.02 62.48,70.38 v61.92,70.38 | v16.13,80.59 22.55,87.02 22.55,127.51 79.96,127.51 89.08,118.39 89.08,117.6 v85.83,114.35
BIN2  (via drill 0.35)
  Top 0.152: U1.82 87.91,108.38 87.66,108.64 v87.48,109.17 | MOT_IC2.16 26.64,38.99 34.98,38.99 v36.35,40.36 | v41.45,39.9 45.59,39.9 v46.25,39.24 | v83.49,51.21 82.42,50.14 82.42,46.99 v83.26,46.15
  Bottom 0.152: v36.35,40.36 41,40.36 v41.45,39.9 | v46.25,39.24 46.25,37.06 50.11,33.2 81.36,33.2 82.93,34.77 82.93,41.78 82.32,42.39 82.32,45.21 v83.26,46.15 | v83.49,51.21 84.63,51.21 103.94,70.51 107.04,70.51 109.37,72.85 109.37,84.56 104.5,89.43 100.48,89.43 98.58,91.34 98.58,97.64 96.52,99.7 96.52,109.55 87.86,109.55 v87.48,109.17
BIN2_2  (via drill 0.35)
  Top 0.152: U1.84 86.91,107.14 85.19,108.86 85.19,111.86 85.27,111.94 85.27,112.32 84.23,113.36 84.23,116.74 v84.94,117.45 | MOT_IC1.16 66.65,39.01 v66.67,38.99 | v57.4,65.68 35.79,65.68 23.27,78.21 v23.27,78.41 | v24.49,84.38 19.99,88.88 v19.05,88.88 | v19.36,124.18 25.63,124.18 v25.83,124.38
  Bottom 0.152: v66.67,38.99 57.48,48.18 57.48,65.68 v57.4,65.68 | v23.27,78.41 24.66,79.81 24.66,84.2 v24.49,84.38 | v19.05,88.88 19.05,123.88 v19.36,124.18 | v25.83,124.38 78,124.38 v84.94,117.45
BO
  Top 0.381: MOT_IC2.11 18.23,37.79 18.03,37.59 | MOT_IC2.12 17.6,37.14 17.59,37.15
  Top 0.762: MOT2.1 17.27,36.83 17.59,37.15 18.03,37.59
BO1
  Top 0.381: MOT_IC1.11 56.13,37.71 56.01,37.59 | MOT_IC1.12 55.48,37.06 55.25,36.83
  Top 0.762: MOT3.1 55.25,36.83 56.01,37.59
BO2
  Top 0.381: MOT_IC2.8 17.41,39.74 17.4,39.75 | MOT_IC2.7 18.04,40.39 17.91,40.26
  Top 0.762: MOT2.2 13.08,39.75 17.4,39.75 17.91,40.26
BO3
  Top 0.381: MOT_IC1.7 56.32,40.31 55.88,39.88 55.63,39.88 | MOT_IC1.8 56.43,39.66 56.32,39.56 55.31,39.56
  Top 0.762: MOT3.2 55.12,39.37 55.31,39.56 55.63,39.88
BOOT
  Top 0.152: IC3.2 51.75,28.43
  Top 0.381: 51.75,28.43 C_BOOT.2
BOOT_1
  Top 0.381: IC4.2 104.6,29.08 100.46,29.08 99.72,28.35 C_BOOT1.2
BOOT_2
  Top 0.381: IC1.2 94.55,55.98 CB.2
BUCK_3V3  (via drill 0.35)
  Top 0.152: MOT_IC2.20 27.34,41.69 31.93,46.28 35.49,46.28 C41.2 C42.2 41.12,47.96 v41.12,56.41 | MOT_IC1.20 71.92,41.61 73.94,43.64 C9.2 78.74,44.63 | U1.11 48.84,92.19 C31.1 44.98,92.38 44.98,89.13 | U1.28 79.91,81.11 78.11,79.3 C29.1 73.1,79.3 73.91,78.49 73.91,77.72 v73.66,77.47 | U1.50 92.11,83.49 C28.1 95.45,82.35 v95.25,82.55 | U1.75 106.64,97.19 C27.1 111.53,100.86 111.76,101.09 111.76,102.87 v110.49,104.14 | U1.100 76.42,98.89 C32.1 73.26,102 v72.39,102.87 | U1.6 77.16,94.74 73.1,94.74 C49.1 67.54,99.39 v66.98,98.83 | JP19.1 30.43,104.22 v32.41,104.22 | U1.21 73.95,87.19 72.08,85.32 52.15,85.32 48.23,89.23 C19.2 46.91,89.23 C3.2 44.98,89.13 | U1.19 67.46,88.19 65.73,86.46 57.1,86.46 55.88,87.68 54.03,87.68 C30.1 54.76,86.79 v55.07,86.79 | 44.98,89.13 42.45,89.13 v41.68,88.37 | C5.2 62.8,115.29 v62.25,115.29 | R21.1 3,84.81 v3,85.6 | CAM.1 10.01,98.22 v10.72,97.51 | C2.2 80.42,43.94 79.38,43.94 79.07,43.64 78.74,43.64 78.74,44.63 | 78.74,44.63 78.74,47.88 80.01,49.15 80.01,53.21 79.5,53.72 v79.56,53.78 | R18.2 55.97,123.09 v55.88,123.19 | R22.2 58.85,122.76 v58.42,123.19 | R16.2 63.59,123.1 v63.5,123.19 | U2.8 59.04,117.36 59.82,116.59 59.82,114.56 C6.2 62.18,114.25 v62.23,114.3 | U2.5 56.65,116.21 v56.39,115.95 | IC2.4 112.97,50.61 113.16,50.8 v113.16,56.77 | ST-LINK.3 129.03,122.68 v128.27,121.92 | R25.2 87.5,52.32 87.63,52.45
  Top 0.203: ESP32_PW.1 10.29,95.71 v10.77,95.23
  Top 0.508: C11.2 87.5,58.04 88.45,57.09 | C13.2 86.36,56.13 87.76,54.74 | C14.2 87,54.23 87.76,53.47 | C15.2 87.63,52.45 87.76,52.45
  Top 1.143: L1.1 87.88,54.61 87.76,54.74 | 87.76,54.74 v87.76,56.39 88.45,57.09 88.9,57.53 v88.9,58.42 | 87.76,54.74 87.76,53.47 87.76,52.45
  Route15 0.152: 79.56,56.32 78.74,57.15
  Bottom 0.152: v79.56,53.78 78.74,54.61 78.74,57.15 v80.01,58.42
  pour Route15: 0.36,55.78 149.94,55.78 149.94,141.17 -0.25,141.17 0.03,56.11
BUCK_5V2  (via drill 0.35, 0.51)
  Top 0.152: v107.44,41.4 107.35,41.49 C17.2 | IC2.20 119.24,47.36 121.34,49.45 v123.27,49.45 | v84.86,37.21 86.13,35.94 BUZZER.BUZ+ | US_1.1 134.19,33.83 v133.91,34.11 | C34.2 79.02,14.48 R7.2 | C12.1 101.58,43.15 v101.6,43.18 | C10.1 99.03,43.15 v99.06,43.18 | R26.2 104.27,54.86 106.55,54.86 107.82,56.13
  Top 0.508: 78.61,27.69 78.36,27.94 C25.2 | C26.2 78.49,24.13 78.61,24 | C33.2 78.49,20.32 78.61,20.19 | C34.2 77.85,16.51 78.61,17.27 | 80.52,31.75 80.26,32
  Top 0.635: LS_1.1 134.37,36.35 v134.19,36.17 | LS_2.1 119.3,35.84 v119.1,35.64 | LS_3.1 119.63,33.12 v119.48,33.27
  Top 1.27: 78.61,23.11 78.61,24 78.61,27.69 78.61,30.35 80.26,32 v83.82,35.56 | 78.61,23.11 78.61,20.19 78.61,17.27 | v83.82,31.75 80.52,31.75 | 78.61,23.11 78.87,22.86 L2.1 | IC1.8 102.88,57.78 C22.2 105.67,58.29 107.82,56.13 109.73,54.23 v109.73,53.72
  pour Route15: 82.63,29.29 148.56,29.29 149.78,30.51 149.78,55.12 82.63,55.12
BUCK_5V_1  (via drill 0.35)
  Top 0.152: R24.2 24.51,22.1 24,22.61 24,25.4
  Top 0.254: FAN.1 v7.26,48.26
  Top 0.381: v26.67,35.56 26.54,35.7 MOT_IC2.13 | MOT_IC2.13 MOT_IC2.14 | MOT_IC2.24 26.54,45.58 v26.67,45.72 | MOT_IC2.13 28.11,37.14 C44.2 C43.2 | v64.77,35.56 64.51,35.82 MOT_IC1.13 MOT_IC1.14 70.87,37.71 71.63,36.96 75.49,36.96 C8.2 78.97,37.14 C4.2 | MOT_IC1.24 63.5,45.22 v63.5,45.72
  Top 0.508: C16.2 23.75,33.02 v24,32.77 | C18.2 23.88,30.48 24,30.35 | C21.2 24,27.94 | C23.2 24,25.4
  Top 1.27: v24,32.77 24,30.35 24,27.94 24,26.54 | 24,26.54 24,25.4 | L3.1 25.15,25.4 24,26.54
  other vias: 24.13,30.48
  pour Route15: 0.08,29.29 81.2,29.29 81.2,55.04 0.08,55.04
BUZ-
  Top 0.152: BUZZER.BUZ- 93.75,35.56 93.75,35.86 93.75,40.41 Q1.3
BUZZER_CTR  (via drill 0.35)
  Top 0.152: U1.32 81.91,79.37 77.5,74.95 74.6,74.95 73.1,73.46 v70.92,73.46 | R1.1 84.71,41.07 84.71,41.66 v88.06,41.66 | v106.58,69.47 96.88,69.47 v95.94,70.41
  Bottom 0.152: v88.06,41.66 88.32,41.91 89.59,41.91 92.48,44.81 93.75,44.81 99.54,44.81 102.62,47.88 102.62,59.56 106.58,63.52 v106.58,69.47 | v95.94,70.41 90.93,75.41 72.87,75.41 v70.92,73.46
CS
  Top 0.152: R16.1 63.59,119.36 62.71,119.36 62.56,119.51 59.69,119.51 59.18,119.51 58.67,120.02 57.91,120.02 57.65,119.75 U2.12
CTS  (via drill 0.35)
  Top 0.152: IC2.11 v107.31,46.05 | U1.71 107.2,95.19 107.26,95.12 112.9,95.12 v113.92,96.14
  Bottom 0.152: v107.31,46.05 106.07,46.05 103.51,48.62 103.51,59.51 110.24,66.24 110.24,93.12 113.18,96.06 113.84,96.06 v113.92,96.14
DCMI_D0  (via drill 0.35)
  Top 0.152: U1.63 101.42,91.19 v101.7,91.47
  Bottom 0.152: CAM3.1 102.26,92.02 v101.7,91.47
DCMI_D1  (via drill 0.35)
  Top 0.152: U1.64 94.28,91.69 94.74,92.15 103.43,92.15 v103.94,91.64
  Bottom 0.152: CAM3.2 104.8,92.51 v103.94,91.64
DCMI_D2  (via drill 0.35)
  Top 0.152: U1.97 80.41,100.89 80.34,100.97 77.8,100.97 76.63,102.13 v76.22,102.13
  Bottom 0.152: CAM4.1 61.42,101.65 61.87,101.19 63.6,101.19 65.02,102.62 67.18,102.62 68.96,100.84 74.93,100.84 v76.22,102.13
DCMI_D3  (via drill 0.35)
  Top 0.152: U1.98 79.91,100.38 79.7,100.58 76.66,100.58 75.01,102.23 75.01,102.64 v74.73,102.92
  Bottom 0.152: CAM4.2 64.39,106.3 73.79,106.3 74.73,105.36 v74.73,102.92
DCMI_D4  (via drill 0.35)
  Top 0.152: U1.3 74.6,96.19 v73.38,97.41 | v44.96,99.75 46,98.7 49.33,98.7 v49.99,99.37 | v53.9,101.85 59.28,101.85 59.41,101.73 59.74,101.73 v59.82,101.8
  Bottom 0.152: CAM5.1 39.24,105.28 44.78,99.75 v44.96,99.75 | v49.99,99.37 52.48,101.85 v53.9,101.85 | v59.82,101.8 59.82,98.42 63.27,94.97 70.59,94.97 73.03,97.41 v73.38,97.41
DCMI_D5  (via drill 0.35)
  Top 0.152: U1.92 82.91,103.24 78.99,107.16 v78.99,109.22 | v85.5,123.9 84.4,122.81 v76.81,122.81 | v70.13,123.32 70.13,119.84 73.51,116.46 v75.87,116.46
  Bottom 0.152: CAM6.1 85.19,129.56 85.19,124.21 v85.5,123.9 | v76.81,122.81 70.64,122.81 v70.13,123.32 | v75.87,116.46 75.87,116.15 78.99,113.03 v78.99,109.22
DCMI_D6  (via drill 0.35)
  Top 0.152: U1.4 73.61,95.69 70.31,98.98 70.31,99.52 v70.46,99.67 | CAM5.2 43.05,106.66 v43.05,104.55 | v46.69,102.06 47.7,101.04 60.78,101.04 v62.64,99.19
  Bottom 0.152: v43.05,104.55 46,101.6 46.69,101.6 v46.69,102.06 | v62.64,99.19 65.02,96.8 69.9,96.8 70.46,97.36 v70.46,99.67
DCMI_D7  (via drill 0.35)
  Top 0.152: U1.5 73.42,95.19 69.01,99.59 69.01,101.17 67.28,102.9 52.02,102.9 50.8,104.12 v50.8,106.68
  Bottom 0.152: v50.8,106.68 45.57,106.68 CAM5.3
DCMI_HSYNC  (via drill 0.35)
  Top 0.152: U1.29 80.41,81.15 77.17,77.9 v76.02,77.9
  Bottom 0.152: CAM7.1 66.78,72.51 66.78,77.32 69.14,79.68 74.73,79.68 76.02,78.38 v76.02,77.9
DCMI_PIXCLK  (via drill 0.35)
  Top 0.152: U1.31 81.41,80.12 79.5,78.21 v79.05,78.21
  Bottom 0.152: CAM7.2 66.34,75.64 66.34,77.42 69.32,80.39 77.14,80.39 79.05,78.49 v79.05,78.21
DCMI_VSYNC  (via drill 0.35)
  Top 0.152: U1.93 82.41,103.16 77.24,108.33 v77.24,109.68
  Bottom 0.152: CAM8.1 74.65,115.47 76.38,113.74 76.38,110.54 v77.24,109.68
DRAIN
  Top 0.152: RES.2 91.52,44.3 92.63,43.18 Q1.1
ELBOW  (via drill 0.35)
  Top 0.152: PH1.1 125.45,4.06 124.77,3.38 45.47,3.38 v43.36,5.49 | U1.24 75.3,85.69 73.25,83.64 69.49,83.64 67.03,81.18 v66.4,81.18
  Bottom 0.152: v43.36,5.49 43.36,58.14 v66.4,81.18
EN/SYNC
  Top 0.152: IC3.7 59.82,28.57 59.94,28.45 R2.2 | R23.1 63.5,26.16 61.22,28.45
  Top 0.381: R2.2 61.22,28.45
EN/SYNC_1
  Top 0.152: IC4.7 113.56,29.11 R6.2 117.45,27.71 119,26.16 R8.1
EN/SYNC_2
  Top 0.152: IC1.7 102.23,56.51 | 102.23,56.51 R13.2 | R26.1 102.23,54.86 102.23,56.51
FB
  Top 0.152: IC3.6 58.55,27.3 59.82,26.04 59.82,22.23 52.83,15.24 29.84,15.24 29.72,15.24 28.07,16.89 28.07,20.07 27.81,20.32 26.67,20.32 | R24.1 26.67,20.32 | 26.67,20.32 R3.2
FB_1
  Top 0.152: R7.1 83.82,12.7 101.73,12.7 106.17,17.14 106.17,20.07 107.82,21.72 112.52,21.72 113.16,22.35 113.16,23.62 111.89,24.89 111.89,27.05 111.1,27.84 IC4.6
  Top 0.381: 83.82,12.7 R5.2
FB_2
  Top 0.152: R25.1 87.5,49.28 | 87.5,49.28 R14.2 | IC1.6 101.14,54.61 101.73,54.61 101.85,54.48 101.85,51.43 99.7,49.28 87.5,49.28
GND  (via drill 0.35)
  Top 0.152: C41.1 C42.1 39.86,45.23 v40.64,44.45 | v79.93,40.72 77.98,42.67 C9.1 | R10.1 132.82,48.97 v132.31,48.97 | C17.1 v105.39,38.43 | RES.1 v83.74,44.3 | v12.88,61.57 3.99,61.57 LED.COM | IC3.5 57.4,26.04 57.66,25.78 | C37.2 v13.79,74.78 12.27,74.78 11.25,73.76 | RESET.3 4.4,73.88 5.28,73 10.49,73 11.25,73.76 | 11.25,73.76 11.25,75.96 RESET.4 | 51.16,90.7 51.82,90.7 C30.2 | 51.16,90.7 49.35,90.7 C31.2 45.72,92.15 v45.72,91.44 | IC2.21 117.9,48.08 119.15,48.08 121.87,50.8 v121.92,50.8 | IC2.26 120.65,51.26 121.56,52.17 v122.3,52.17 | JP19.2 32.82,100.25 v33.71,99.37 | v105.51,48.26 106.98,48.26 107.62,47.62 108.13,47.62 109.14,48.64 110.7,48.64 IC2.7 | U1.74 95.65,96.69 95.78,96.83 106.91,96.83 110.26,100.18 111.51,100.18 111.51,99.52 C20.2 110.31,97.61 v109.22,96.52 | C1.2 94.16,79.12 94.16,78.11 v94.11,78.05 | C29.2 71.63,78.33 | 71.63,78.33 70.06,78.33 69.98,78.41 69.93,78.41 v69.85,78.33 | U1.27 79.41,81.5 77.95,80.04 71.53,80.04 71.09,79.6 71.09,78.87 71.63,78.33 | U1.20 73.66,87.69 71.93,85.96 54.17,85.96 51.21,88.92 v50.62,88.92 50.62,90.17 51.16,90.7 | C47.2 48.18,86.31 C19.1 46.91,88.26 C3.1 | C3.1 C48.2 | C3.1 44.55,88.16 v44.27,87.88 | 51.16,90.7 | U1.10 72.26,92.69 72.21,92.63 69.8,92.63 v69.24,93.19 | C49.2 65.13,101.27 64.97,101.12 v64.97,101.02 | U1.99 79.41,99.86 79.2,100.08 76.15,100.08 74.37,101.85 74.37,101.91 C32.2 71.4,104.88 v70.94,104.88 | R4.2 75.82,109.47 v73.15,109.47 | R17.1 52.5,115.37 v52.65,115.21 | v99.37,98.98 99.57,99.19 107.67,99.19 C27.2 108.18,101.83 v107.95,101.6 | ST-LINK.9 136.8,127.15 136.8,124.41 135.89,123.5 v135.89,121.92 | ST-LINK.7 134.11,123.75 133.71,123.34 v133.71,120.75
  Top 0.152: MOT_IC1.18 70.76,40.31 v71.12,39.95 | MOT_IC2.18 30.84,40.39 v30.89,40.44 | 141.81,36.73 v141.81,36.7 | CAM.2 11.76,100.76 v13.03,99.49 | v138.68,46.23 122.66,46.23 C40.2 | USB_A.4 143.59,43.08 143.46,43.08 v141.68,41.3 | C7.2 138.81,52.09 v138.81,51.05 | R2.1 v60.96,25.4 | R6.1 116.81,26.7 v116.84,26.67 | 47.94,35.11 48.01,35.18 | 48.59,35.12 48.64,35.18 | 49.23,35.14 49.28,35.18 | R3.1 v26.67,16.51 | R5.1 v83.82,8.89 | C6.1 58.67,113.28 v58.42,113.03 | 29.21,33.1 v29.23,33.07 | C4.1 79.22,36.34 | C2.1 80.44,42.34 v80.01,41.91 | v120.02,50.29 119.7,50.61 IC2.25 | C12.2 102.01,40.23 v102.87,39.37 | C10.2 99.47,40.23 v100.33,39.37 | US_1.2 141.78,31.29 v142.24,31.75 | RES1.1 v136.78,51.05 | IC2.18 121.12,46.06 v121.28,46.23 | C28.2 95.45,76.78 v95.38,76.71 | U2.6 57.15,115.57 v57.53,115.19 | U2.7 57.65,116.34 v58.42,115.57 | C5.1 v65.4,113.29 v65.41,113.28 | ST-LINK.5 131.57,122.68 v130.81,121.92 | R13.1 103.89,56.01 104.65,56.01 v105.16,56.51 | v101.73,60.08 v101.73,60.07 | R14.1 88.27,46.86 v88.27,46.61
  Top 0.203: ESP32_PW.2 8.43,93.17 v8.89,92.71
  Top 0.254: FAN.2 v3.81,41.91
  Top 0.381: C_VCC1.1 v102.26,24.66 | U5.2 101.31,36.42 101.73,36.83 102.87,36.83 | 102.87,36.83 103.51,36.83 | 103.51,36.83 v106.68,36.83 | U3.3 47.94,35.11 | U3.2 48.59,35.12 | U3.1 49.23,35.14 | C_VCC.1 50.31,24.13 v50.8,24.13 | MOT_IC2.3 17.46,42.99 | 17.34,42.99 17.14,42.99 17.8,42.34 MOT_IC2.4 | 17.46,42.99 17.34,42.99 | 17.34,42.99 17.27,42.93 | 17.46,42.99 17.4,42.93 | MOT_IC2.9 18.14,39.09 18.03,38.99 | MOT_IC2.10 17.57,38.44 17.53,38.48 | C43.1 v33.02,33.02 | C44.1 29.21,33.1 | MOT_IC1.3 55.87,42.91 55.56,42.61 | MOT_IC1.4 55.91,42.26 55.88,42.29 | MOT_IC1.9 56.16,39.01 55.88,38.73 | MOT_IC1.10 55,38.36 54.99,38.35 | C8.1 76.27,35.56 v77.47,35.56 | 79.22,36.34 v80.01,35.56 | U4.3 92.39,63.43 92.58,63.63 | 95.12,63.63 v95.25,63.5 | U4.2 93.03,63.32 93.34,63.63 | U4.1 93.69,63.33 93.98,63.63 | CV.1 92.96,51.05 v92.84,50.93 | U5.1 103.51,36.61 103.51,36.83 | U5.3 100.67,36.91 101.09,37.34 102.36,37.34 102.87,36.83
  Top 0.508: 57.66,25.78 57.66,24.89 v58.42,24.13 | IC4.5 110.49,26.13 v110.49,24.13 | C16.1 v19.05,33.02 | C18.1 v19.05,30.48 | C21.1 v19.05,27.94 | C23.1 v19.05,25.4 | C25.1 v72.39,27.94 | C26.1 v73.66,24.13 | C33.1 v73.66,20.32 | C34.1 v73.66,16.51 | C11.1 86.33,59.56 v86.49,59.56 | C13.1 83.82,56.13 v83.19,56.77 | C14.1 83.57,53.24 v83.57,53.21 | C15.1 85.98,51.15 v85.98,50.55 | IC1.5 100.5,52.62 v100.46,52.58
  Top 0.635: LS_1.2 139.65,38.89 141.81,36.73 | LS_2.2 129.92,38.38 v130.3,38 | LS_3.2 129.44,30.58 v129.54,30.48
  Top 0.762: 48.01,35.18 48.64,35.18 49.28,35.18 49.91,35.18 v50.8,34.29 | v16.51,43.18 17.02,43.18 17.27,42.93 17.4,42.93 | v16.51,38.1 17.14,38.1 17.53,38.48 18.03,38.99 | v54.61,43.18 54.99,43.18 55.56,42.61 55.88,42.29 | v53.72,38.33 53.75,38.35 54.99,38.35 55.5,38.35 55.88,38.73 | 92.58,63.63 93.34,63.63 93.98,63.63 95.12,63.63
  Top 1.27: v54.61,24.13 IC3.9 | C24.1 v67.31,21.59 | IC4.9 107.95,27.86 v107.95,24.13 | IC1.9 v97.79,52.45 | C22.1 v101.73,60.08
  Top 1.422: C35.1 122.81,21.59 v119.38,21.59
  Top 1.905: PH2.3 v136.91,11.68 | PH1.3 136.65,9.14 v136.78,9.27
  Top 3.81: B1.- J1.3 J1.4
  other vias: 120.65,21.59
  pour Route2: -1.19,-1.19 152.32,-1.19 152.32,140.89 -1.19,140.89
GRIPPER  (via drill 0.35)
  Top 0.152: U1.25 76.48,84.45 75.01,84.45 74.75,84.2 v74.75,83.57 | PH2.1 128.98,16.76 119.18,6.96 v49.05,6.96
  Bottom 0.152: v49.05,6.96 44.58,11.43 44.58,58.04 67.41,80.87 73.33,80.87 74.75,82.3 v74.75,83.57
I2C2_SCL
  Top 0.152: U1.47 89.41,71.6 95.73,65.28 120.52,65.28 128.02,57.78 130.53,57.78 130.71,57.96 US_2.2 136.93,66.75 CAM2.2
I2C2_SDA
  Top 0.152: U1.48 89.91,71.86 95.76,66.02 121.69,66.02 122.2,66.52 127.64,66.52 128.17,65.99 US_2.1 128.17,60.73 134.39,66.95 CAM2.1
INT_1  (via drill 0.35)
  Top 0.152: U1.79 89.41,113.66 v88.39,114.68 | v49.78,120.85 66.45,137.52 v89.18,137.52 89.18,124.92 89.1,124.84 89.1,124.48 v89.15,124.44 | U2.4 55.94,116.72 v55.07,115.85
  Bottom 0.152: v55.07,115.85 50.06,120.85 v49.78,120.85 | v88.39,114.68 88.39,115.9 89.92,117.42 89.92,119.3 89.15,120.07 v89.15,124.44
INT_2  (via drill 0.35)
  Top 0.152: v60.71,116.1 60.71,116.48 60.02,117.17 59.33,117.86 U2.9 | U1.80 88.91,112.33 88.98,112.4 v87.94,113.44 | v65.38,119.96 65.38,132.87 66.5,133.98 66.7,133.98 v67.06,133.63
  Bottom 0.152: v60.71,116.1 64.57,119.96 v65.38,119.96 | v67.06,133.63 69.37,135.94 97.71,135.94 97.71,113.28 88.09,113.28 v87.94,113.44
MCO1  (via drill 0.35)
  Top 0.152: U1.67 93.95,93.19 94.06,93.29 105.94,93.29 v106.43,92.81
  Bottom 0.152: CAM9.1 117.98,92.05 117.98,96.62 116.84,97.77 114.1,97.77 109.14,92.81 v106.43,92.81
N$1
  Top 0.152: R4.1 81.86,102.41 81.86,98.93 U1.94
N$2  (via drill 0.35)
  Top 0.152: JP2.2 32.46,92.46 32.59,92.33 32.72,92.33 32.84,92.46 34.24,91.06 v41.35,91.06 | U1.13 77.14,91.26 57.56,91.26 55.58,89.28 v55.58,89.08
  Bottom 0.152: v55.58,89.08 53.9,89.08 51.49,91.49 50.9,91.49 49.2,89.79 42.62,89.79 v41.35,91.06
N$13
  Top 0.152: U1.73 107.21,96.19 C20.1
N$14
  Top 0.152: C48.1 47.55,84.89 C47.1 72.31,84.89 74.09,86.67 77.19,86.67 U1.22
N$15
  Top 0.152: U1.49 90.41,81.5 91.74,80.16 C1.1
N$16  (via drill 0.35)
  Top 0.152: JP2.1 34.21,89.92 34.77,89.36 35.97,89.36 v37.01,88.32 | U1.12 77.16,91.74 55.59,91.74 v54.25,90.4
  Bottom 0.152: v54.25,90.4 53.24,90.4 48.36,95.28 43.97,95.28 v37.01,88.32
N$18
  Top 0.152: U1.1 75.94,97.19 68.91,104.22 68.91,111 68.4,111.51 51.89,111.51 37.92,97.54 JP3.1
N$19
  Top 0.152: JP3.2 36.4,95 52.4,111 67.69,111 68.58,110.11 68.58,104.09 76.02,96.65 77.17,96.65 U1.2
N$22
  Top 0.152: U1.46 88.91,69.69 JP4.1
N$27
  Top 0.152: U1.43 87.41,72.73 85.8,71.12 85.8,65.05 JP5.1
N$28
  Top 0.152: U1.41 86.41,73.2 83.77,70.56 83.77,67.72 81.15,65.1 80.75,65.1 JP6.1
N$29
  Top 0.152: U1.38 84.91,78.08 82.17,75.34 82.17,71.93 EPS32_1.2
N$30
  Top 0.152: EPS32_1.1 82.73,69.95 82.73,75.31 85.41,78 U1.39
N$31
  Top 0.152: U1.61 109.94,90.19 JP8.1
N$32
  Top 0.152: JP8.2 111.98,90.69 U1.62
N$33  (via drill 0.35)
  Top 0.152: U1.87 85.41,105.52 v83.67,107.26 | ESP32.1 105.82,75.01 v103.84,76.99
  Bottom 0.152: v83.67,107.26 86.74,107.26 94.87,99.14 94.87,86.46 103.84,77.5 v103.84,76.99
N$34  (via drill 0.35)
  Top 0.152: U1.88 84.91,104.22 82.17,106.96 82.17,112.52 82.75,113.11 v83.01,113.11 | ESP32.2 105.74,77.55 v104.72,78.56
  Bottom 0.152: v83.01,113.11 83.01,112.32 95.66,99.67 95.66,87.02 104.12,78.56 v104.72,78.56
N$35  (via drill 0.35)
  Top 0.152: U1.55 98.23,87.19 v98.4,87.02
  Bottom 0.152: v98.4,87.02 100.58,87.02 JP7.1
N$36
  Top 0.152: U1.56 92.68,87.76 99.24,87.76 99.72,87.27 99.72,85.09 102.34,82.47 103.4,82.47 104.29,81.59 105.64,82.94 JP7.3
N$37
  Top 0.152: U1.57 103.1,88.19 107.77,83.52 107.77,81.59 JP7.4
N$38  (via drill 0.35)
  Top 0.152: U1.58 103.72,88.69 v105.23,87.17
  Bottom 0.152: JP7.2 103.6,85.54 v105.23,87.17
N$39
  Top 0.152: U1.65 94.17,92.19 94.62,92.63 104.29,92.63 105.41,91.52 113.79,91.52 114.15,91.16 123.04,91.16 JP1.1
N$40
  Top 0.152: U1.66 94.03,92.69 94.31,92.96 104.72,92.96 105.79,91.9 123.17,91.9 JP1.2
N$41
  Top 0.152: U1.78 89.91,115.24 89.94,115.27 89.99,115.32 91.44,116.76 JP9.1
N$51
  Top 0.152: JP10.3 54.69,97.28 70.05,97.28 73.15,94.19 U1.7
N$52
  Top 0.152: JP10.2 69.8,96.27 72.38,93.69 U1.8
N$53
  Top 0.152: JP10.1 53.67,94.23 71.2,94.23 72.24,93.19 U1.9
N$54  (via drill 0.35)
  Top 0.152: JP11.1 40.21,85.85 35.64,85.85 v35.38,86.11 | U1.18 77.14,88.61 66.44,88.61 v65.35,87.53 | v55.02,78.87 53.77,78.87 51.87,80.77 v51.87,81.1
  Bottom 0.152: v65.35,87.53 56.69,78.87 v55.02,78.87 | v51.87,81.1 49.05,83.92 35.71,83.92 35.38,84.25 v35.38,86.11
N$55
  Top 0.152: JP16.3 96.72,76.84 96.72,84.71 96.25,85.19 U1.51
N$56
  Top 0.152: JP16.2 97.23,78.87 97.23,85.09 96.6,85.73 92.65,85.73 U1.52
N$57
  Top 0.152: JP16.1 97.87,80.77 97.87,85.01 96.69,86.19 U1.53
N$59
  Top 0.152: U1.36 83.91,78.6 80.64,75.34 80.64,73.41 77.93,70.69 75.77,70.69 JP13.2
N$60
  Top 0.152: U1.37 84.41,78.32 81.61,75.51 81.61,73.56 76.58,68.53 JP13.1
N$64
  Top 0.152: JP17.2 74.91,112.34 79.43,112.34 81.28,110.49 81.28,106.37 81.23,106.31 83.61,103.93 83.91,103.63 U1.90
N$67
  Top 0.152: R9.2 134.09,53.29 135.51,51.87 135.51,49.66 136.25,48.91 142.42,48.91 USB_A.1
N$68
  Top 0.152: U1.91 83.41,103.43 80.64,106.2 80.64,109.98 80.09,110.54 72.92,110.54 72.36,111.1 JP17.1
N$71
  Top 0.152: U1.77 90.41,105.58 90.37,105.62 90.37,112.01 JP14.1
N$72
  Top 0.152: U1.23 74.35,86.19 72.21,84.05 60.55,84.05 58.37,81.86 JP15.1
PA3_RED  (via drill 0.35)
  Top 0.152: U1.26 77.82,82.4 v71.45,82.4 | R11.2 12.6,69.7 v12.8,69.49 | v28.63,75.29 29.9,74.02 44.09,74.02 v45.36,75.29 | v48.16,76.73 49.68,76.73 52.38,74.04 v52.49,74.16
  Bottom 0.152: v12.8,69.49 18.59,75.29 v28.63,75.29 | v45.36,75.29 46.81,76.73 v48.16,76.73 | v52.49,74.16 60.73,82.4 v71.45,82.4
PA5_GREEN  (via drill 0.35)
  Top 0.152: U1.30 80.91,81.14 75.54,75.77 70.99,75.77 69.72,74.5 69.72,71.25 68.33,69.85 67.31,69.85 v63.88,66.42 | v20.02,64.8 18.92,65.89 R12.2 | v31.14,72.03 40.51,72.03 46.05,66.5 55.83,66.5 v56.64,67.31
  Bottom 0.152: v20.02,64.8 24.54,69.32 29.44,69.32 31.14,71.02 v31.14,72.03 | v56.64,67.31 59,69.67 60.63,69.67 v63.88,66.42
PB0_BLUE  (via drill 0.35)
  Top 0.152: U1.35 83.41,78.77 79.98,75.34 79.98,73.56 77.89,71.46 73.5,71.46 71.75,69.72 71.75,65.02 70.61,63.88 61.21,63.88 55.96,69.14 54.84,69.14 54.13,68.43 v51.16,68.43 | v22.61,59.21 22.28,59.54 R15.2 | v30.05,64.9 31.39,64.9 v32.94,63.35 | v42.9,71.53 43.99,71.53 v46.3,69.22
  Bottom 0.152: v22.61,59.21 28.3,64.9 v30.05,64.9 | v32.94,63.35 34.72,63.35 v42.9,71.53 | v46.3,69.22 47.09,68.43 v51.16,68.43
PE13
  Top 0.152: R15.1 12.55,58.85 LED.R
PE15
  Top 0.152: R12.1 12.12,64.11 3.99,64.11 LED.G
PE16
  Top 0.152: R11.1 6.02,68.68 LED.B
PWDN  (via drill 0.35)
  Top 0.152: U1.17 64.85,89.19 v63.32,87.66
  Bottom 0.152: CAM1.2 57.89,105.97 57.89,94.46 63.32,89.03 v63.32,87.66
PWMA  (via drill 0.35)
  Top 0.152: U1.40 85.91,74.41 v83.95,72.44 | MOT_IC1.23 66.86,43.56 v75.72,52.43
  Bottom 0.152: v75.72,52.43 75.72,57.51 83.24,65.02 83.24,71.73 v83.95,72.44
PWMA2  (via drill 0.35)
  Top 0.152: U1.44 87.91,64.64 83.57,60.3 78.08,60.3 75.49,62.89 40.72,62.89 v33.78,55.96 | MOT_IC2.23 27.51,43.64 27.76,43.89 27.76,45.01 30.76,48.01 v35.33,48.01
  Bottom 0.152: v33.78,55.96 35.33,54.41 v35.33,48.01
PWMB  (via drill 0.35)
  Top 0.152: U1.42 86.91,72.89 84.38,70.36 84.38,67.01 v84.43,66.95 | v71.93,38.66 71.55,38.28 64.59,38.28 MOT_IC1.15 | v82.17,58.34 79.53,55.7 69.37,55.7 v68.2,54.53
  Bottom 0.152: v68.2,54.53 64.77,51.1 64.77,48.21 71.7,41.27 72.26,41.27 72.26,38.99 v71.93,38.66 | v82.17,58.34 84.43,60.6 v84.43,66.95
PWMB2  (via drill 0.35)
  Top 0.152: v37.06,38.66 36.84,38.44 MOT_IC2.15 | U1.45 88.41,63.27 81.92,56.77 81.92,41.91 83.11,40.72 83.11,36.65 81.01,34.56 55.63,34.56 54.37,35.81 49.4,35.81 48.23,36.98 v41.68,36.98
  Bottom 0.152: v37.06,38.66 40,38.66 v41.68,36.98
RESET  (via drill 0.35)
  Top 0.152: RESET.1 3.63,81.6 3.63,82.02 | 3.63,82.02 R21.2 | RESET.2 10.9,82.24 9.98,83.16 4.77,83.16 3.63,82.02 | C37.1 13.79,79.73 12.69,80.83 RESET.2 | U1.14 77.11,90.79 58.96,90.79 57.2,89.03 v57.2,88.24 | U1.16 77.11,89.79 63.42,89.79 v61.19,87.55 | ST-LINK.12 129.26,139.78 25.35,139.78 15.88,130.3 15.88,92.71 18.03,90.55 25.27,90.55 29.84,85.98 | 29.84,85.98 33.02,82.8 v54.23,82.8 | RESET.2 14.27,84.2 20.83,84.2 22.73,82.3 26.16,82.3 29.84,85.98
  Bottom 0.152: CAM1.1 55.68,106.3 55.68,91.03 57.2,89.51 v57.2,88.24 | v57.2,88.24 58.17,89.2 61.19,89.2 v61.19,87.55 | v54.23,82.8 57.2,85.78 v57.2,88.24
RTS  (via drill 0.35)
  Top 0.152: R9.1 R10.2 | R10.2 | R10.2 v131.04,50.75 | IC2.19 120.75,46.71 122.23,48.18 v124.54,48.18 | IC2.3 106.6,51.26 105.28,52.58 v105.28,53.34 | U1.70 106.47,94.69 106.53,94.74 116.15,94.74 v116.66,94.23
  Bottom 0.152: 130.25,49.96 v131.04,50.75 128.88,50.75 117.15,62.48 117.15,93.75 v116.66,94.23 | 130.25,49.96 128.47,48.18 v124.54,48.18 | v105.28,53.34 106.81,51.82 119.63,51.82 121.67,53.85 122.68,53.85 126.37,50.16 130.05,50.16 130.25,49.96
RXD  (via drill 0.35)
  Top 0.152: IC2.5 110.62,49.86 107.26,49.86 107.24,49.83 v107.24,49.61 | U1.68 109.39,93.69 109.88,93.19 112.9,93.19 v113.13,92.96
  Bottom 0.152: v107.24,49.61 104.09,52.76 104.09,59.38 111.18,66.47 111.18,91.44 112.7,92.96 v113.13,92.96
SCL  (via drill 0.35)
  Top 0.152: U1.95 81.41,101.75 74.95,108.2 72.8,108.2 64.39,116.61 61.44,116.61 v61.44,118.14 | v60.96,120.65 59.08,120.65 R22.1 58.37,120.4 57.28,120.4 57.15,120.27 U2.13
  Bottom 0.152: v61.44,118.14 60.96,118.62 v60.96,120.65
SDA
  Top 0.152: U1.96 80.91,101.16 80.59,101.47 78.44,101.47 75.82,104.09 74.19,104.09 73.74,103.63 73.3,103.63 69.55,107.39 69.55,110.87 68.45,111.96 52.2,111.96 51,113.16 51,120.78 51.15,120.93 R18.1 56.65,120.26 U2.14
SDO/SA0
  Top 0.152: R17.2 53.28,118.86 U2.1
SHIELD  (via drill 0.35)
  Top 0.152: USB_A.SH1 144.68,39.37 v143.51,39.37 | v141.73,50.67 141.41,50.36 139.7,52.07 140.01,52.38 | 140.01,52.38 USB_A.SH2 | RES1.2 138.41,53.47 C7.1 140.01,52.77 140.01,52.38
  Bottom 0.152: v143.51,39.37 140.97,39.37 140.84,39.5 140.84,49.78 v141.73,50.67
SHOULDER
  Top 0.152: U1.60 104.93,89.69 104.95,89.66 107.82,89.66 109.73,87.76 109.73,86.03 110.97,84.79 124.89,84.79 LS1.1
STBY  (via drill 0.35)
  Top 0.152: MOT_IC2.19 26.54,40.94 26.66,40.94 26.69,40.91 28.3,40.91 28.85,41.47 R19.2 R19.1 32.99,43.31 33.02,43.34 33.02,43.43 v31.8,44.65 | 77.24,38.63 77.19,38.68 R20.2 | 77.24,38.63 74.99,38.63 72.55,41.07 64.79,41.07 64.69,40.96 MOT_IC1.19 | v59.06,87.53 61.74,90.21 77.19,90.21 U1.15 | v75.64,42.21 75.64,42.07 77.19,40.52 R20.1 77.24,40.49 77.24,38.63 | v68.3,71.45 59.72,80.04 54.13,80.04 v53.92,80.24
  Bottom 0.152: v75.64,42.21 74.37,43.48 74.37,58.09 71.35,61.11 71.35,69.24 69.14,71.45 v68.3,71.45 | v59.06,87.53 59.06,83.8 57.48,83.8 v53.92,80.24 31.8,58.11 v31.8,44.65
SW
  Top 0.152: 47.94,29.9 47.88,29.84 | 47.28,30.29 46.84,29.84
  Top 0.381: C_BOOT.1 47.6,27.46 46.84,28.22 46.84,29.84 | U3.8 49.28,31.46 49.28,29.84 | U3.7 48.59,29.9 48.64,29.84 | U3.6 47.94,29.9 | U3.5 47.28,30.29
  Top 1.27: IC3.1 49.28,29.84 48.64,29.84 47.88,29.84 46.84,29.84 45.25,29.84 L3.2
SW_1
  Top 0.381: C_BOOT1.1 98.45,26.72 97.16,28.01 97.16,28.96 98.58,30.38 98.68,30.38 | U5.8 101.98,32.02 101.98,30.38 | U5.7 101.31,30.41 101.35,30.38 | U5.6 100.71,31.99 100.71,30.38 | U5.5 100.02,30.45 99.95,30.38
  Top 1.27: IC4.1 101.98,30.38 101.35,30.38 100.71,30.38 99.95,30.38 98.68,30.38 96.24,30.38 96.08,30.54 96.08,25.4 93.53,22.86 L2.2
SW_2
  Top 0.381: U4.8 93.69,57.87 93.6,57.78 | U4.7 93.03,57.86 92.96,57.78 | U4.6 92.39,57.97 92.2,57.78 | U4.5 91.73,57.95 91.57,57.78 | CB.1 92.94,55.01 92.08,55.88 92.08,56.39 92.46,56.77 93.73,56.77 94.23,57.28 94.23,57.78
  Top 1.143: L1.2 91.27,55.54 90.17,56.64 91.31,57.78 91.57,57.78
  Top 1.27: IC1.1 94.23,57.78 93.6,57.78 92.96,57.78 92.2,57.78 91.57,57.78
SWCLK  (via drill 0.35)
  Top 0.152: U1.76 90.91,107.78 v93.93,110.8 120.29,137.16 128.27,137.16 131.57,133.86 ST-LINK.6
SWDIO  (via drill 0.35)
  Top 0.152: U1.72 110.44,95.69 v112.14,97.38 112.14,118.36 126.26,132.49 v128.93,132.49 128.93,129.95 ST-LINK.4
SWO
  Top 0.152: U1.89 84.4,104.01 81.64,106.78 81.64,112.67 83.64,114.68 83.64,117.93 86.36,120.65 99.95,120.65 118.11,138.81 128.4,138.81 134.11,133.1 ST-LINK.8
TXD  (via drill 0.35)
  Top 0.152: U1.69 108.51,94.19 108.66,94.34 114.4,94.34 v114.83,93.9 | IC2.1 107.76,52.56 v107.75,52.55
  Bottom 0.152: v107.75,52.55 107.75,60.93 116.1,69.29 116.1,92.63 v114.83,93.9
USBDM
  Top 0.152: USB_A.2 142.71,47.68 139.78,44.76 IC2.16
USBDP
  Top 0.152: USB_A.3 143.65,45.73 142.03,44.11 IC2.15
VCC
  Top 0.152: C_VCC.2 49.53,26.21
  Top 0.381: IC3.3 50.63,27.3 49.53,26.21
VCC_1
  Top 0.152: IC4.3 104.48,27.69
  Top 0.381: 104.48,27.69 102.87,27.69 C_VCC1.2
VCC_2
  Top 0.381: IC1.3 94.62,55.24 92.96,53.59 CV.2